# EAGLE design radio_hub_module (EAGLE 6.6.0)

## Sheet 1 of 3
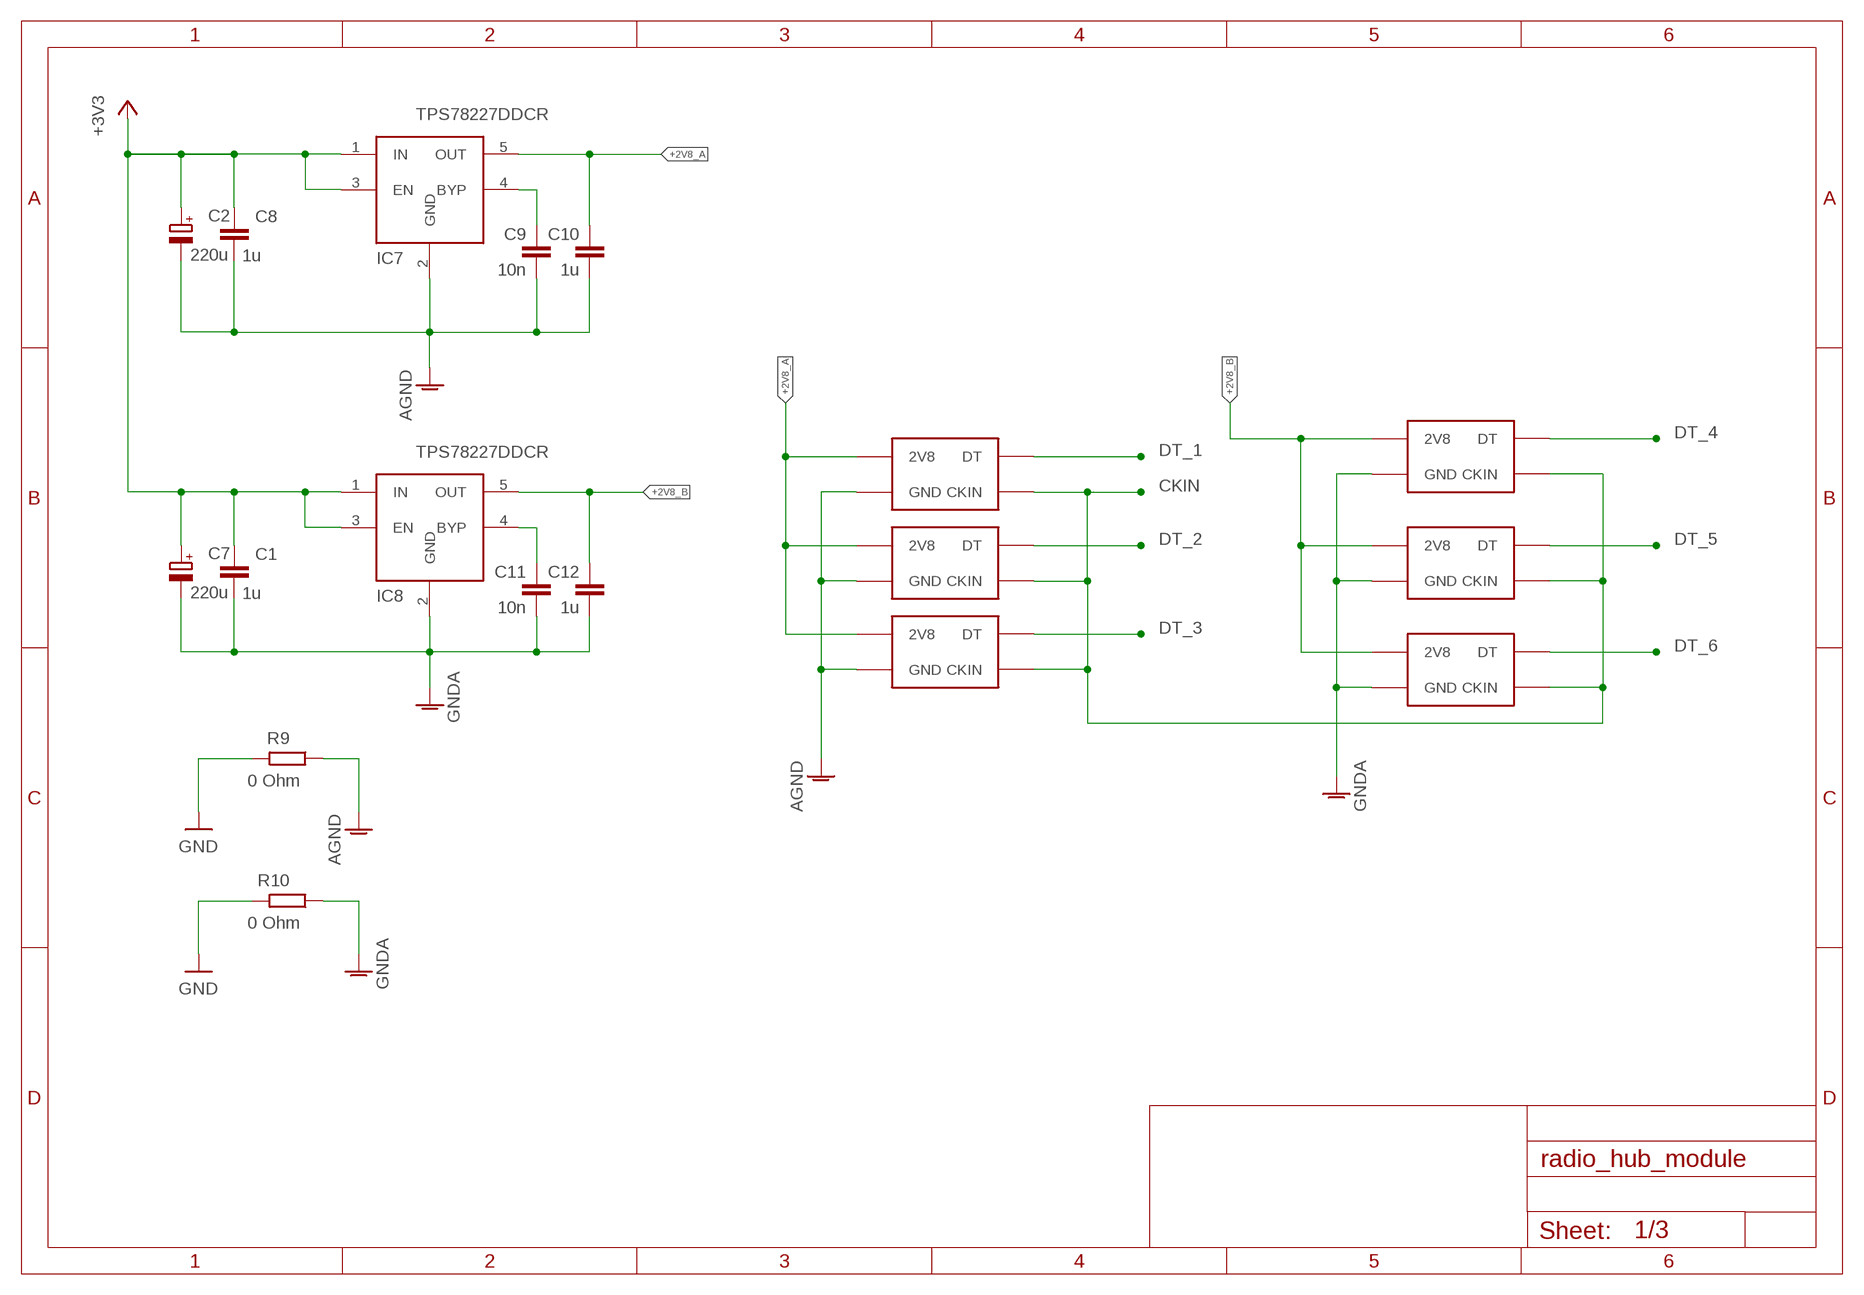
[diagram p0: schematic, sheet 1]

### Parts
C1  1u  C-EUC0603  [C0603]
C2  220u  CPOL-EU1210  [C1210]
C7  220u  CPOL-EU1210  [C1210]
C8  1u  C-EUC0603  [C0603]
C9  10n  C-EUC0603  [C0603]
C10  1u  C-EUC0603  [C0603]
C11  10n  C-EUC0603  [C0603]
C12  1u  C-EUC0603  [C0603]
IC7  TPS78227DDCR  NCP700BSN  [SOT23-5]
IC8  TPS78227DDCR  NCP700BSN  [SOT23-5]
MOD_1  GPS_RADIO_MODULE  [GPS_RADIO_MODULE]
MOD_2  GPS_RADIO_MODULE  [GPS_RADIO_MODULE]
MOD_3  GPS_RADIO_MODULE  [GPS_RADIO_MODULE]
MOD_4  GPS_RADIO_MODULE  [GPS_RADIO_MODULE]
MOD_5  GPS_RADIO_MODULE  [GPS_RADIO_MODULE]
MOD_6  GPS_RADIO_MODULE  [GPS_RADIO_MODULE]
R9  0 Ohm  R-EU_R0805  [R0805]
R10  0 Ohm  R-EU_R0805  [R0805]

### Nets
+2V8_A: C10.1 IC7.5(OUT) MOD_1.2V8@11(2V8) MOD_1.2V8@15(2V8) MOD_1.2V8@16(2V8) MOD_2.2V8@11(2V8) MOD_2.2V8@15(2V8) MOD_2.2V8@16(2V8) MOD_3.2V8@11(2V8) MOD_3.2V8@15(2V8) MOD_3.2V8@16(2V8)
+2V8_B: C12.1 IC8.5(OUT) MOD_4.2V8@11(2V8) MOD_4.2V8@15(2V8) MOD_4.2V8@16(2V8) MOD_5.2V8@11(2V8) MOD_5.2V8@15(2V8) MOD_5.2V8@16(2V8) MOD_6.2V8@11(2V8) MOD_6.2V8@15(2V8) MOD_6.2V8@16(2V8)
+3V3: C1.1 C2.1(+) C7.1(+) C8.1 IC7.1(IN) IC7.3(EN) IC8.1(IN) IC8.3(EN) ; also sheet 2,3
AGND: C2.2(-) C8.2 C9.2 C10.2 IC7.2(GND) MOD_1.GND@1(GND) MOD_1.GND@2(GND) MOD_1.GND@3(GND) MOD_1.GND@4(GND) MOD_1.GND@5(GND) MOD_1.GND@6(GND) MOD_1.GND@7(GND) MOD_1.GND@8(GND) MOD_1.GND@9(GND) MOD_1.GND@10(GND) MOD_1.GND@14(GND) MOD_1.V1(GND) MOD_1.V2(GND) MOD_1.V3(GND) MOD_1.V4(GND) MOD_1.V5(GND) MOD_1.V6(GND) MOD_1.V7(GND) MOD_1.V8(GND) MOD_1.V9(GND) MOD_1.V10(GND) MOD_1.V11(GND) MOD_1.V12(GND) MOD_1.V13(GND) MOD_1.V14(GND) MOD_1.V15(GND) MOD_1.V16(GND) MOD_1.V17(GND) MOD_1.V18(GND) MOD_1.V19(GND) MOD_1.V20(GND) MOD_1.V21(GND) MOD_1.V22(GND) MOD_1.V23(GND) MOD_1.V24(GND) MOD_1.V25(GND) MOD_1.V26(GND) MOD_1.V27(GND) MOD_1.V28(GND) MOD_1.V29(GND) MOD_1.V30(GND) MOD_2.GND@1(GND) MOD_2.GND@2(GND) MOD_2.GND@3(GND) MOD_2.GND@4(GND) MOD_2.GND@5(GND) MOD_2.GND@6(GND) MOD_2.GND@7(GND) MOD_2.GND@8(GND) MOD_2.GND@9(GND) MOD_2.GND@10(GND) MOD_2.GND@14(GND) MOD_2.V1(GND) MOD_2.V2(GND) MOD_2.V3(GND) MOD_2.V4(GND) MOD_2.V5(GND) MOD_2.V6(GND) MOD_2.V7(GND) MOD_2.V8(GND) MOD_2.V9(GND) MOD_2.V10(GND) MOD_2.V11(GND) MOD_2.V12(GND) MOD_2.V13(GND) MOD_2.V14(GND) MOD_2.V15(GND) MOD_2.V16(GND) MOD_2.V17(GND) MOD_2.V18(GND) MOD_2.V19(GND) MOD_2.V20(GND) MOD_2.V21(GND) MOD_2.V22(GND) MOD_2.V23(GND) MOD_2.V24(GND) MOD_2.V25(GND) MOD_2.V26(GND) MOD_2.V27(GND) MOD_2.V28(GND) MOD_2.V29(GND) MOD_2.V30(GND) MOD_3.GND@1(GND) MOD_3.GND@2(GND) MOD_3.GND@3(GND) MOD_3.GND@4(GND) MOD_3.GND@5(GND) MOD_3.GND@6(GND) MOD_3.GND@7(GND) MOD_3.GND@8(GND) MOD_3.GND@9(GND) MOD_3.GND@10(GND) MOD_3.GND@14(GND) MOD_3.V1(GND) MOD_3.V2(GND) MOD_3.V3(GND) MOD_3.V4(GND) MOD_3.V5(GND) MOD_3.V6(GND) MOD_3.V7(GND) MOD_3.V8(GND) MOD_3.V9(GND) MOD_3.V10(GND) MOD_3.V11(GND) MOD_3.V12(GND) MOD_3.V13(GND) MOD_3.V14(GND) MOD_3.V15(GND) MOD_3.V16(GND) MOD_3.V17(GND) MOD_3.V18(GND) MOD_3.V19(GND) MOD_3.V20(GND) MOD_3.V21(GND) MOD_3.V22(GND) MOD_3.V23(GND) MOD_3.V24(GND) MOD_3.V25(GND) MOD_3.V26(GND) MOD_3.V27(GND) MOD_3.V28(GND) MOD_3.V29(GND) MOD_3.V30(GND) R9.1
BYP: C9.1 IC7.4(BYP)
BYP1: C11.1 IC8.4(BYP)
CKIN: MOD_1.CKIN@13(CKIN) MOD_2.CKIN@13(CKIN) MOD_3.CKIN@13(CKIN) MOD_4.CKIN@13(CKIN) MOD_5.CKIN@13(CKIN) MOD_6.CKIN@13(CKIN) ; also sheet 2
DT_1: MOD_1.DT@12(DT) ; also sheet 3
DT_2: MOD_2.DT@12(DT) ; also sheet 3
DT_3: MOD_3.DT@12(DT) ; also sheet 3
DT_4: MOD_4.DT@12(DT) ; also sheet 3
DT_5: MOD_5.DT@12(DT) ; also sheet 3
DT_6: MOD_6.DT@12(DT) ; also sheet 3
GND: R9.2 R10.2 ; also sheet 2,3
GNDA: C1.2 C7.2(-) C11.2 C12.2 IC8.2(GND) MOD_4.GND@1(GND) MOD_4.GND@2(GND) MOD_4.GND@3(GND) MOD_4.GND@4(GND) MOD_4.GND@5(GND) MOD_4.GND@6(GND) MOD_4.GND@7(GND) MOD_4.GND@8(GND) MOD_4.GND@9(GND) MOD_4.GND@10(GND) MOD_4.GND@14(GND) MOD_4.V1(GND) MOD_4.V2(GND) MOD_4.V3(GND) MOD_4.V4(GND) MOD_4.V5(GND) MOD_4.V6(GND) MOD_4.V7(GND) MOD_4.V8(GND) MOD_4.V9(GND) MOD_4.V10(GND) MOD_4.V11(GND) MOD_4.V12(GND) MOD_4.V13(GND) MOD_4.V14(GND) MOD_4.V15(GND) MOD_4.V16(GND) MOD_4.V17(GND) MOD_4.V18(GND) MOD_4.V19(GND) MOD_4.V20(GND) MOD_4.V21(GND) MOD_4.V22(GND) MOD_4.V23(GND) MOD_4.V24(GND) MOD_4.V25(GND) MOD_4.V26(GND) MOD_4.V27(GND) MOD_4.V28(GND) MOD_4.V29(GND) MOD_4.V30(GND) MOD_5.GND@1(GND) MOD_5.GND@2(GND) MOD_5.GND@3(GND) MOD_5.GND@4(GND) MOD_5.GND@5(GND) MOD_5.GND@6(GND) MOD_5.GND@7(GND) MOD_5.GND@8(GND) MOD_5.GND@9(GND) MOD_5.GND@10(GND) MOD_5.GND@14(GND) MOD_5.V1(GND) MOD_5.V2(GND) MOD_5.V3(GND) MOD_5.V4(GND) MOD_5.V5(GND) MOD_5.V6(GND) MOD_5.V7(GND) MOD_5.V8(GND) MOD_5.V9(GND) MOD_5.V10(GND) MOD_5.V11(GND) MOD_5.V12(GND) MOD_5.V13(GND) MOD_5.V14(GND) MOD_5.V15(GND) MOD_5.V16(GND) MOD_5.V17(GND) MOD_5.V18(GND) MOD_5.V19(GND) MOD_5.V20(GND) MOD_5.V21(GND) MOD_5.V22(GND) MOD_5.V23(GND) MOD_5.V24(GND) MOD_5.V25(GND) MOD_5.V26(GND) MOD_5.V27(GND) MOD_5.V28(GND) MOD_5.V29(GND) MOD_5.V30(GND) MOD_6.GND@1(GND) MOD_6.GND@2(GND) MOD_6.GND@3(GND) MOD_6.GND@4(GND) MOD_6.GND@5(GND) MOD_6.GND@6(GND) MOD_6.GND@7(GND) MOD_6.GND@8(GND) MOD_6.GND@9(GND) MOD_6.GND@10(GND) MOD_6.GND@14(GND) MOD_6.V1(GND) MOD_6.V2(GND) MOD_6.V3(GND) MOD_6.V4(GND) MOD_6.V5(GND) MOD_6.V6(GND) MOD_6.V7(GND) MOD_6.V8(GND) MOD_6.V9(GND) MOD_6.V10(GND) MOD_6.V11(GND) MOD_6.V12(GND) MOD_6.V13(GND) MOD_6.V14(GND) MOD_6.V15(GND) MOD_6.V16(GND) MOD_6.V17(GND) MOD_6.V18(GND) MOD_6.V19(GND) MOD_6.V20(GND) MOD_6.V21(GND) MOD_6.V22(GND) MOD_6.V23(GND) MOD_6.V24(GND) MOD_6.V25(GND) MOD_6.V26(GND) MOD_6.V27(GND) MOD_6.V28(GND) MOD_6.V29(GND) MOD_6.V30(GND) R10.1

## Sheet 2 of 3
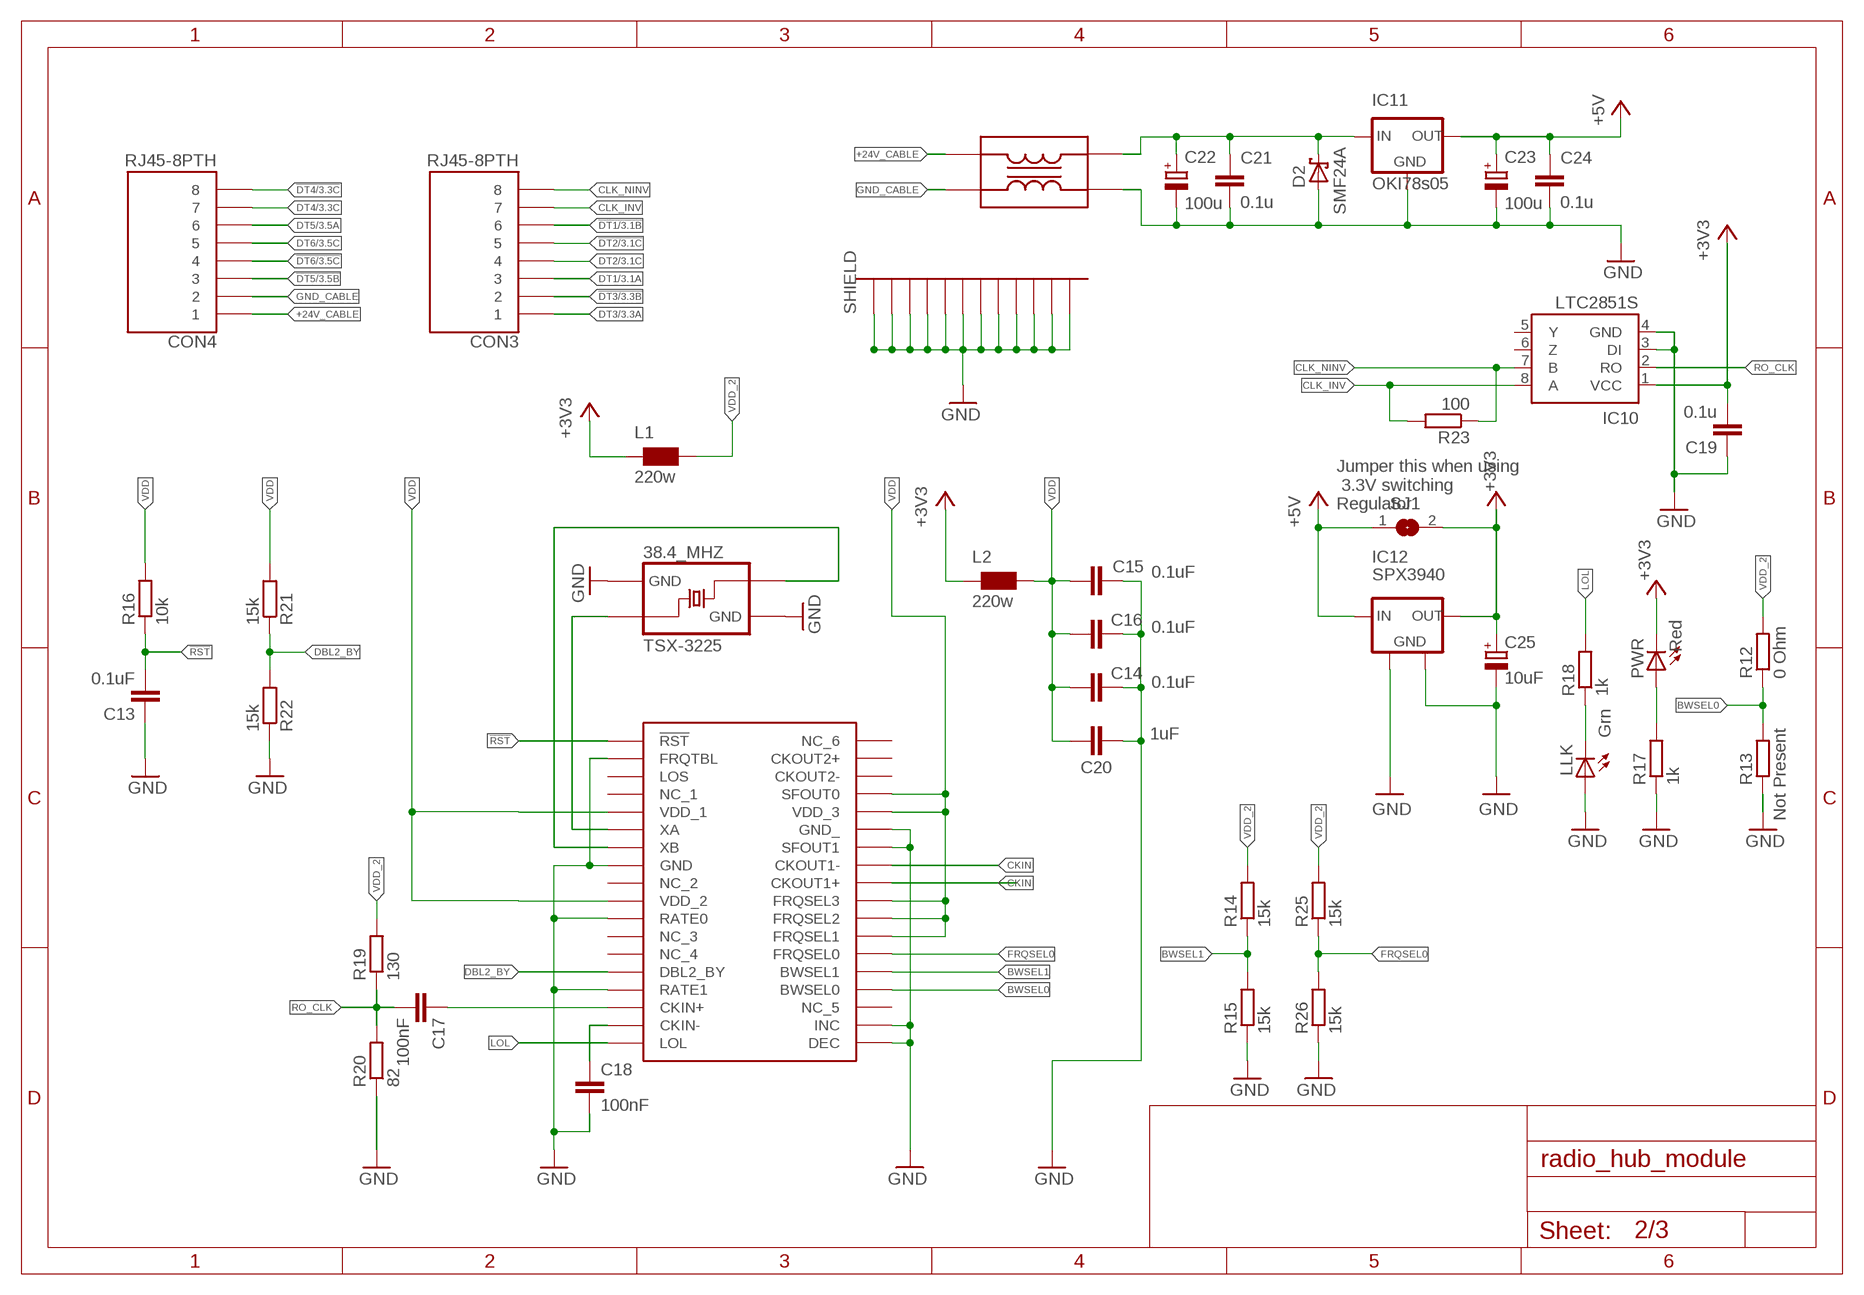
[diagram p1: schematic, sheet 2]

### Parts
38.4_MHZ  TSX-3225  [TSX-3225]
C13  0.1uF  C-EUC0402  [C0402]
C14  0.1uF  C-EUC0402  [C0402]
C15  0.1uF  C-EUC0402  [C0402]
C16  0.1uF  C-EUC0402  [C0402]
C17  100nF  C-EUC0402  [C0402]
C18  100nF  C-EUC0402  [C0402]
C19  0.1u  C-EUC0805  [C0805]
C20  1uF  C-EUC0402  [C0402]
C21  0.1u  C-EUC0805  [C0805]
C22  100u  CPOL-EUE5-10.5  [E5-10,5]
C23  100u  CPOL-EUE5-10.5  [E5-10,5]
C24  0.1u  C-EUC0805  [C0805]
C25  10uF  CPOL-EUE2-5  [E2-5]
CON3  RJ45-8PTH  [RJ45-8]
CON4  RJ45-8PTH  [RJ45-8]
D2  SMF24A  [SOD123]
IC9  SI5317  [QFN-36]
IC10  LTC2851S  [SOIC8]
IC11  OKI78s05  V_REG_OKI-78SRSINK  [TO220-IGO]
IC12  SPX3940  [SOT223]
L1  220w  WE-CBF_0805  [0805]
L2  220w  WE-CBF_0805  [0805]
L3  ACM3225-601-2P-T001  [ACM3225-601-2P-T001]
LLK  Grn  LEDCHIPLED_0805  [CHIPLED_0805]
PWR  Red  LEDCHIPLED_0805  [CHIPLED_0805]
R12  0 Ohm  R-EU_R0603  [R0603]
R13  Not Present  R-EU_R0603  [R0603]
R14  15k  R-EU_R0603  [R0603]
R15  15k  R-EU_R0603  [R0603]
R16  10k  R-EU_R0402  [R0402]
R17  1k  R-EU_R0603  [R0603]
R18  1k  R-EU_R0603  [R0603]
R19  130  R-EU_R0603  [R0603]
R20  82  R-EU_R0603  [R0603]
R21  15k  R-EU_R0603  [R0603]
R22  15k  R-EU_R0603  [R0603]
R23  100  R-EU_R0603  [R0603]
R25  15k  R-EU_R0603  [R0603]
R26  15k  R-EU_R0603  [R0603]
SH1  BMIS-202  [BMIS-202]
SJ1  SJ  [SJ]

### Nets
24V_IN: C21.1 C22.+ D2.C IC11.IN L3.4
!DT1: CON3.6 ; also sheet 3
!DT2: CON3.5 ; also sheet 3
!DT3: CON3.2 ; also sheet 3
!DT4: CON4.8 ; also sheet 3
!DT5: CON4.3 ; also sheet 3
!DT6: CON4.4 ; also sheet 3
!RST: C13.2 IC9.1(!RST) R16.1
+3V3: C19.2 C25.+ IC10.1(VCC) IC12.3(OUT) L1.1 L2.1 PWR.C SJ1.2 ; also sheet 1,3
+5V: C23.+ C24.1 IC11.OUT IC12.1(IN) SJ1.1
+24V_CABLE: CON4.1 L3.1
BWSEL0: IC9.22(BWSEL0) R12.1 R13.2
BWSEL1: IC9.23(BWSEL1) R14.1 R15.2
CKIN: IC9.28(CKOUT1+) IC9.29(CKOUT1-) ; also sheet 1
CKIN+: C17.1 IC9.16(CKIN+)
CKIN-: C18.1 IC9.17(CKIN-)
CLK_INV: CON3.7 IC10.8(A) R23.2
CLK_NINV: CON3.8 IC10.7(B) R23.1
DBL2_BY: IC9.14(DBL2_BY) R21.1 R22.2
DT1: CON3.3 ; also sheet 3
DT2: CON3.4 ; also sheet 3
DT3: CON3.1 ; also sheet 3
DT4: CON4.7 ; also sheet 3
DT5: CON4.6 ; also sheet 3
DT6: CON4.5 ; also sheet 3
FRQSEL0: IC9.24(FRQSEL0) R25.1 R26.2
GND: 38.4_MHZ.PIN_2(GND_2) 38.4_MHZ.PIN_4(GND_1) C13.1 C14.1 C15.1 C16.1 C18.2 C19.1 C20.1 C21.2 C22.- C23.- C24.2 C25.- D2.A IC9.2(FRQTBL) IC9.8(GND) IC9.11(RATE0) IC9.15(RATE1) IC9.19(DEC) IC9.20(INC) IC9.30(SFOUT1) IC9.31(GND_) IC10.3(DI) IC10.4(GND) IC11.GND IC12.2(GND) IC12.4(GND) L3.3 LLK.A R13.1 R15.1 R17.1 R20.1 R22.1 R26.1 SH1.P$1(GND) SH1.P$2(GND) SH1.P$3(GND) SH1.P$4(GND) SH1.P$5(GND) SH1.P$6(GND) SH1.P$7(GND) SH1.P$8(GND) SH1.P$9(GND) SH1.P$10(GND) SH1.P$11(GND) SH1.P$12(GND) ; also sheet 1,3
GND_CABLE: CON4.2 L3.2
LOL: IC9.18(LOL) R18.2
N$1: PWR.A R17.2
N$11: LLK.C R18.1
RO_CLK: C17.2 IC10.2(RO) R19.1 R20.2
VDD: C14.2 C15.2 C16.2 C20.2 IC9.5(VDD_1) IC9.10(VDD_2) IC9.25(FRQSEL1) IC9.26(FRQSEL2) IC9.27(FRQSEL3) IC9.32(VDD_3) IC9.33(SFOUT0) L2.2 R16.2 R21.2
VDD_2: L1.2 R12.2 R14.2 R19.2 R25.2
XA: 38.4_MHZ.PIN_1(CON_1) IC9.6(XA)
XB: 38.4_MHZ.PIN_3(CON_2) IC9.7(XB)
Unconnected: IC9.3(LOS) IC9.4(NC_1) IC9.9(NC_2) IC9.12(NC_3) IC9.13(NC_4) IC9.21(NC_5) IC9.34(CKOUT2-) IC9.35(CKOUT2+) IC9.36(NC_6) IC10.5(Y) IC10.6(Z)

### Notes on the sheet
- Jumper this when using
   3.3V switching
  Regulator

## Sheet 3 of 3
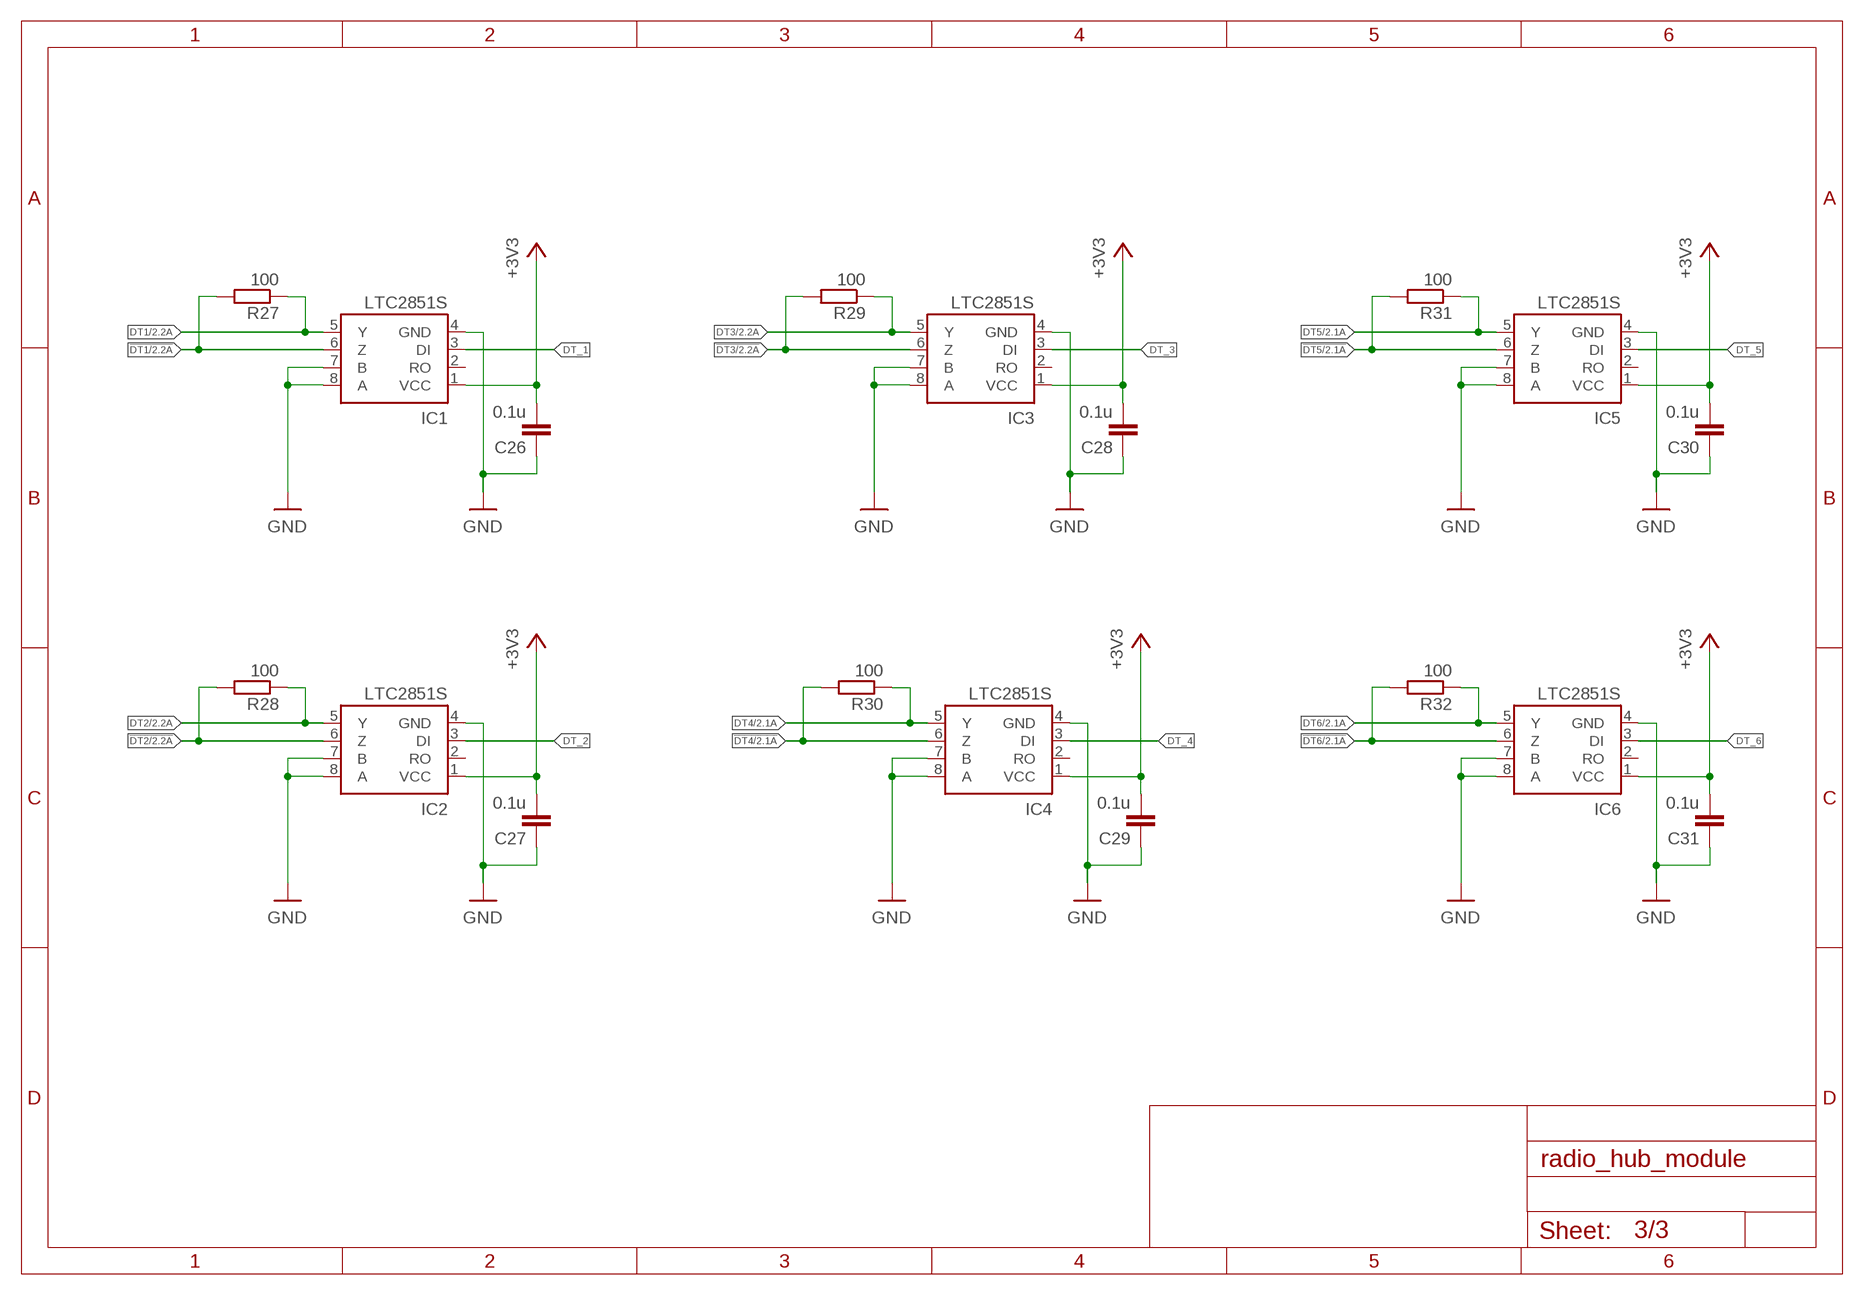
[diagram p2: schematic, sheet 3]

### Parts
C26  0.1u  C-EUC0805  [C0805]
C27  0.1u  C-EUC0805  [C0805]
C28  0.1u  C-EUC0805  [C0805]
C29  0.1u  C-EUC0805  [C0805]
C30  0.1u  C-EUC0805  [C0805]
C31  0.1u  C-EUC0805  [C0805]
IC1  LTC2851S  [SOIC8]
IC2  LTC2851S  [SOIC8]
IC3  LTC2851S  [SOIC8]
IC4  LTC2851S  [SOIC8]
IC5  LTC2851S  [SOIC8]
IC6  LTC2851S  [SOIC8]
R27  100  R-EU_R0603  [R0603]
R28  100  R-EU_R0603  [R0603]
R29  100  R-EU_R0603  [R0603]
R30  100  R-EU_R0603  [R0603]
R31  100  R-EU_R0603  [R0603]
R32  100  R-EU_R0603  [R0603]

### Nets
!DT1: IC1.6(Z) R27.2 ; also sheet 2
!DT2: IC2.6(Z) R28.2 ; also sheet 2
!DT3: IC3.6(Z) R29.2 ; also sheet 2
!DT4: IC4.6(Z) R30.2 ; also sheet 2
!DT5: IC5.6(Z) R31.2 ; also sheet 2
!DT6: IC6.6(Z) R32.2 ; also sheet 2
+3V3: C26.2 C27.2 C28.2 C29.2 C30.2 C31.2 IC1.1(VCC) IC2.1(VCC) IC3.1(VCC) IC4.1(VCC) IC5.1(VCC) IC6.1(VCC) ; also sheet 1,2
DT1: IC1.5(Y) R27.1 ; also sheet 2
DT2: IC2.5(Y) R28.1 ; also sheet 2
DT3: IC3.5(Y) R29.1 ; also sheet 2
DT4: IC4.5(Y) R30.1 ; also sheet 2
DT5: IC5.5(Y) R31.1 ; also sheet 2
DT6: IC6.5(Y) R32.1 ; also sheet 2
DT_1: IC1.3(DI) ; also sheet 1
DT_2: IC2.3(DI) ; also sheet 1
DT_3: IC3.3(DI) ; also sheet 1
DT_4: IC4.3(DI) ; also sheet 1
DT_5: IC5.3(DI) ; also sheet 1
DT_6: IC6.3(DI) ; also sheet 1
GND: C26.1 C27.1 C28.1 C29.1 C30.1 C31.1 IC1.4(GND) IC1.7(B) IC1.8(A) IC2.4(GND) IC2.7(B) IC2.8(A) IC3.4(GND) IC3.7(B) IC3.8(A) IC4.4(GND) IC4.7(B) IC4.8(A) IC5.4(GND) IC5.7(B) IC5.8(A) IC6.4(GND) IC6.7(B) IC6.8(A) ; also sheet 1,2
Unconnected: IC1.2(RO) IC2.2(RO) IC3.2(RO) IC4.2(RO) IC5.2(RO) IC6.2(RO)

## Power pins joined to a net without a drawn wire
GND: IC9.GND_PAD(GND) IC9.GND_VIA_1(GND) IC9.GND_VIA_2(GND) IC9.GND_VIA_3(GND) IC9.GND_VIA_4(GND) IC9.GND_VIA_5(GND)

## Library data of the parts
38.4_MHZ = texas_lvds:TSX-3225: MHz Range Crystal Unit Miniature Size Low Profile SMD
C1 C8-C21 C24 C26-C31 = rcl:C-EU: CAPACITOR, European symbol
C2 C7 = rcl_1:CPOL-EU: POLARIZED CAPACITOR, European symbol
C22 C23 C25 = rcl:CPOL-EU: POLARIZED CAPACITOR, European symbol
CON3 CON4 = SparkFun:RJ45-8: RJ45 Jack Simple RJ45, 8-pin connection - connector for common Cat5, Cat5e, and Cat6 Ethernet cables. Footprint not yet proven in production. Connector sku is PRT-00643; Breakout PCB sku is BOB-00716.
D2 = texas_lvds:SMF24A: TVS DIODE 200W SOD-123F 24V UNI by Littelfuse Inc
IC1-IC6 IC10 = texas_lvds:LTC2851: 3.3V 20Mbps RS485/RS422 Transceiver - Full Duplex no Enable Source: http://cds.linear.com/docs/Datasheet/285012fd.pdf
IC7 IC8 = on_ldo:NCP700B: NCP700B 200mA LDO Regulator
IC9 = texas_lvds:SI5317: Jitter attenuation without clock multiplication.
IC11 = texas_lvds:V_REG_OKI-78SR: Voltage Regulator Standard 7805 5V regulator. IGO (Input Ground Output). Spark Fun Electronics SKU : COM-00107
IC12 = texas_lvds:SPX3940: Voltage regulator with a low drop out voltage of 280mV (typical) at 1A
L1 L2 = wuerth-elektronik:WE-CBF: SMD EMI Suppression Ferrite Beads - excellent anti-EMI properties - low DCR - impedances till 3000 ohms - rated current up to 6 A
L3 = texas_lvds:ACM3225-601-2P-T001: TDK Common Mode Filter For High-speed Differential Signal Line / General Signal Line
LLK PWR = led:LED: LED OSRAM: - CHIPLED LG R971, LG N971, LY N971, LG Q971, LY Q971, LO R971, LY R971 LH N974, LH R974 LS Q976, LO Q976, LY Q976 LO Q996 - Hyper CHIPLED LW Q18S LB Q993, LB Q99A, LB R99A - SideLED LS A670, LO A670, LY A670, LG A670, LP A670 LB A673, LV A673, LT A673, LW A673 LH A674 LY A675 LS A676, LA A676, LO A676, LY A676, LW A676 LS A679, LY A679, LG A679 - Hyper Micro SIDELED® LS Y876, LA Y876, LO Y876, LY Y876 LT Y87S - SmartLED LW L88C, LW L88S LB L89C, LB L89S, LG L890 LS L89K, LO L89K, LY L89K LS L896, LA L896, LO L896, LY L896 - TOPLED LS T670, LO T670, LY T670, LG T670, LP T670 LSG T670, LSP T670, LSY T670, LOP T670, LYG T670 LG T671, LOG T671, LSG T671 LB T673, LV T673, LT T673, LW T673 LH T674 LS T676, LA T676, LO T676, LY T676, LB T676, LH T676, LSB T676, LW T676 LB T67C, LV T67C, LT T67C, LS T67K, LO T67K, LY T67K, LW E67C LS E67B, LA E67B, LO E67B, LY E67B, LB E67C, LV E67C, LT E67C LW T67C LS T679, LY T679, LG T679 LS T770, LO T770, LY T770, LG T770, LP T770 LB T773, LV T773, LT T773, LW T773 LH T774 LS E675, LA E675, LY E675, LS T675 LS T776, LA T776, LO T776, LY T776, LB T776 LHGB T686 LT T68C, LB T68C - Hyper Mini TOPLED® LB M676 - Mini TOPLED Santana® LG M470 LS M47K, LO M47K, LY M47K Source: http://www.osram.convergy.de LUXEON: - LUMILED® LXK2-PW12-R00, LXK2-PW12-S00, LXK2-PW14-U00, LXK2-PW14-V00 LXK2-PM12-R00, LXK2-PM12-S00, LXK2-PM14-U00 LXK2-PE12-Q00, LXK2-PE12-R00, LXK2-PE12-S00, LXK2-PE14-T00, LXK2-PE14-U00 LXK2-PB12-K00, LXK2-PB12-L00, LXK2-PB12-M00, LXK2-PB14-N00, LXK2-PB14-P00, LXK2-PB14-Q00 LXK2-PR12-L00, LXK2-PR12-M00, LXK2-PR14-Q00, LXK2-PR14-R00 LXK2-PD12-Q00, LXK2-PD12-R00, LXK2-PD12-S00 LXK2-PH12-R00, LXK2-PH12-S00 LXK2-PL12-P00, LXK2-PL12-Q00, LXK2-PL12-R00 Source: www.luxeon.com KINGBRIGHT: KA-3528ASYC Source: www.kingbright.com
MOD_1-MOD_6 = radio_module:GPS_RADIO_MODULE
R9 R10 R16-R18 R23 R27-R32 = rcl:R-EU_: RESISTOR, European symbol
R12-R15 R19-R22 R25 R26 = resistor:R-EU_: RESISTOR, European symbol
SH1 = laird:BMIS-202: Laird BMI-S-202 EMI Shield
SJ1 = jumper:SJ: SMD solder JUMPER

## Board
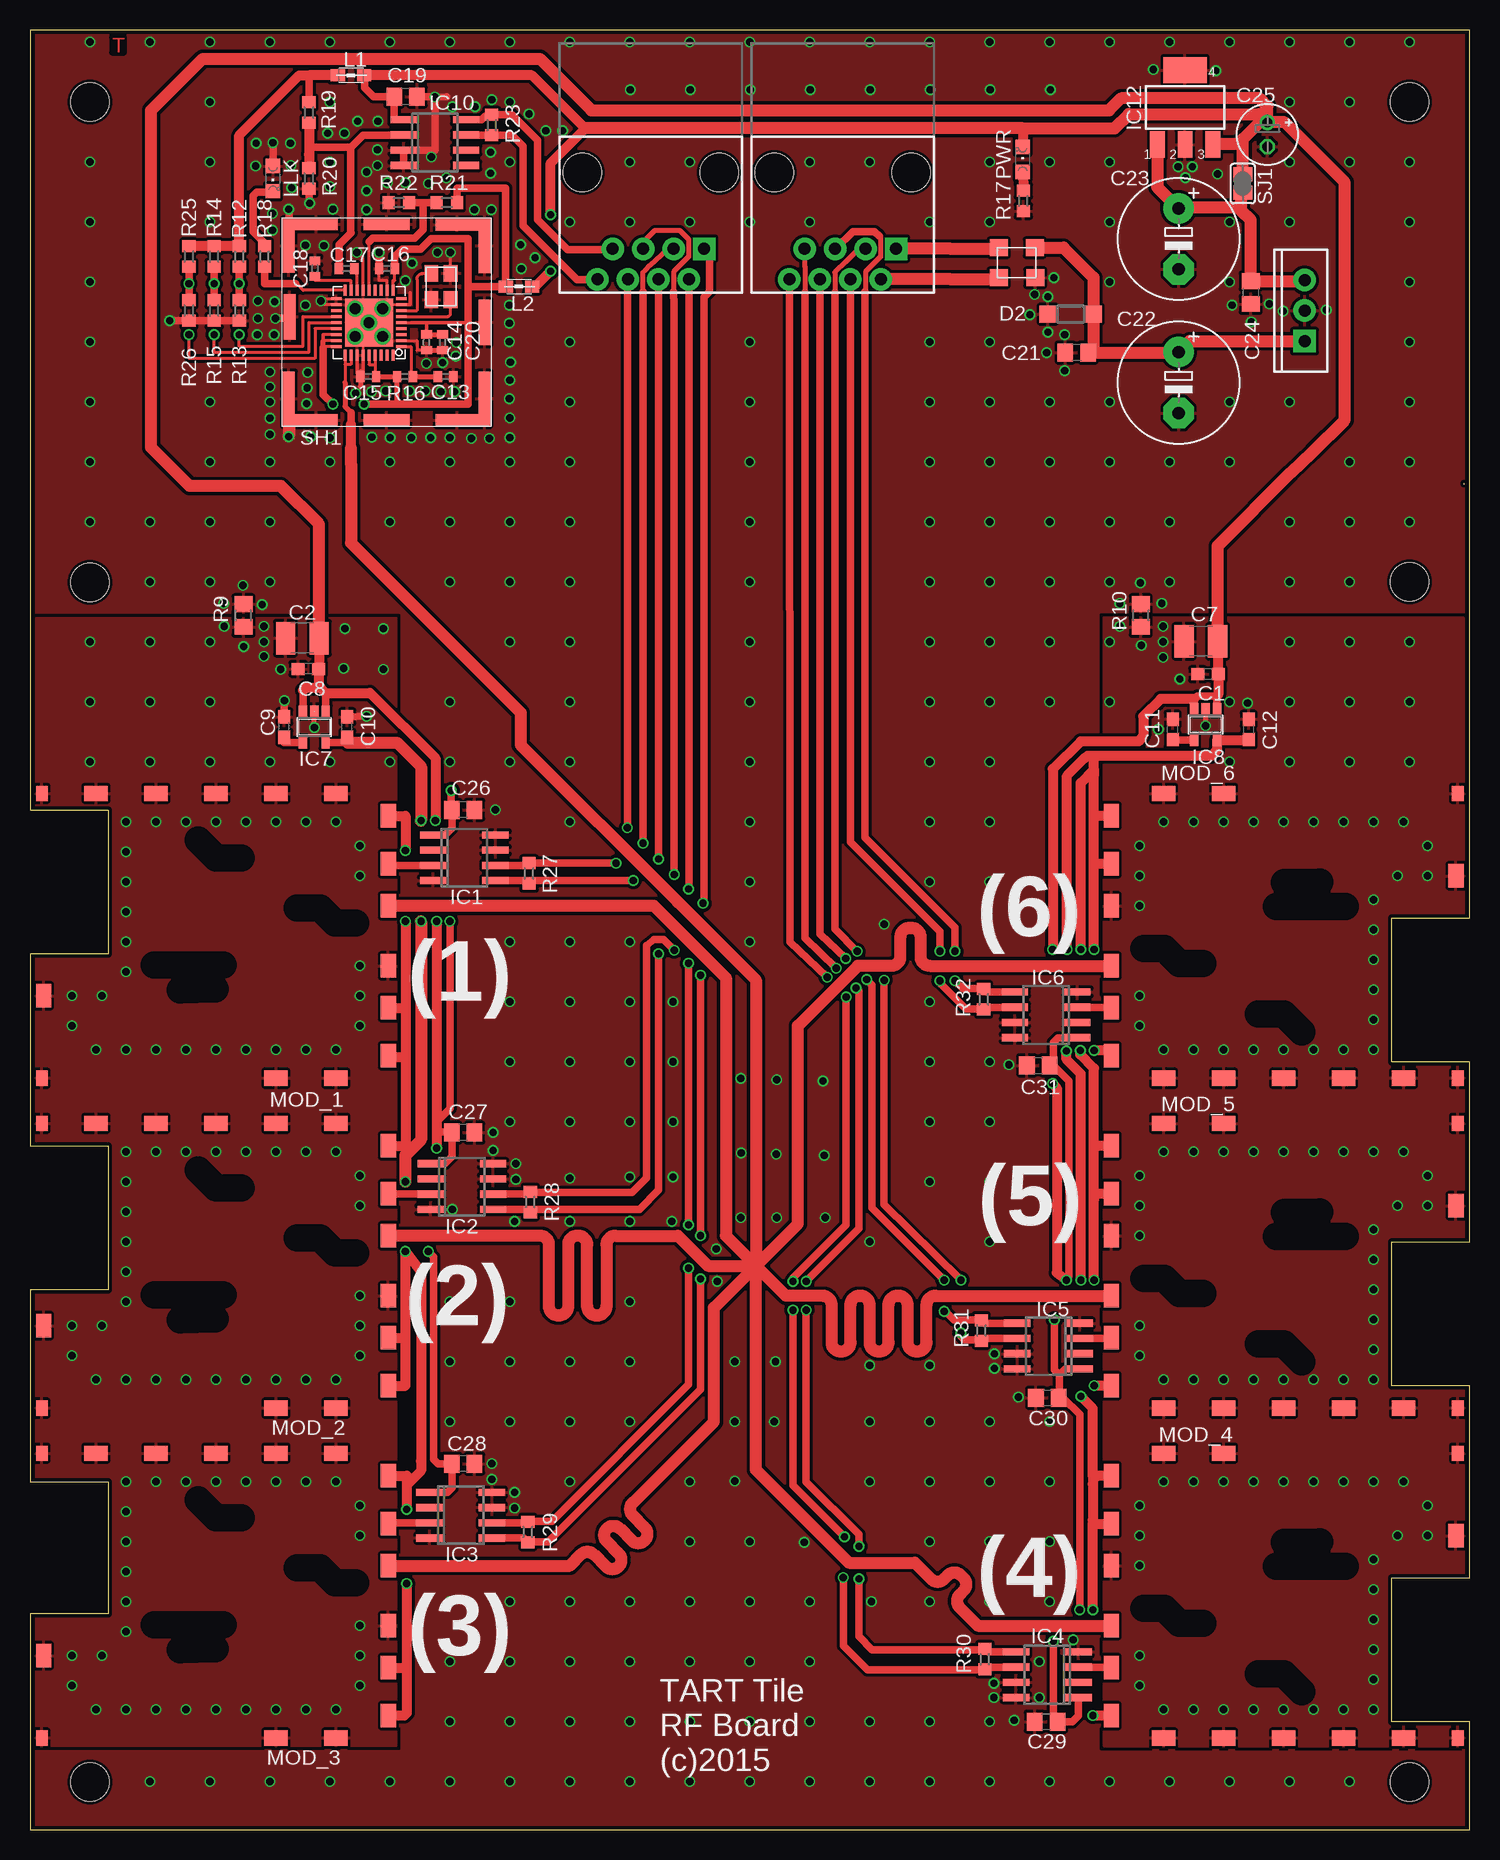
[diagram p3: board, top side]
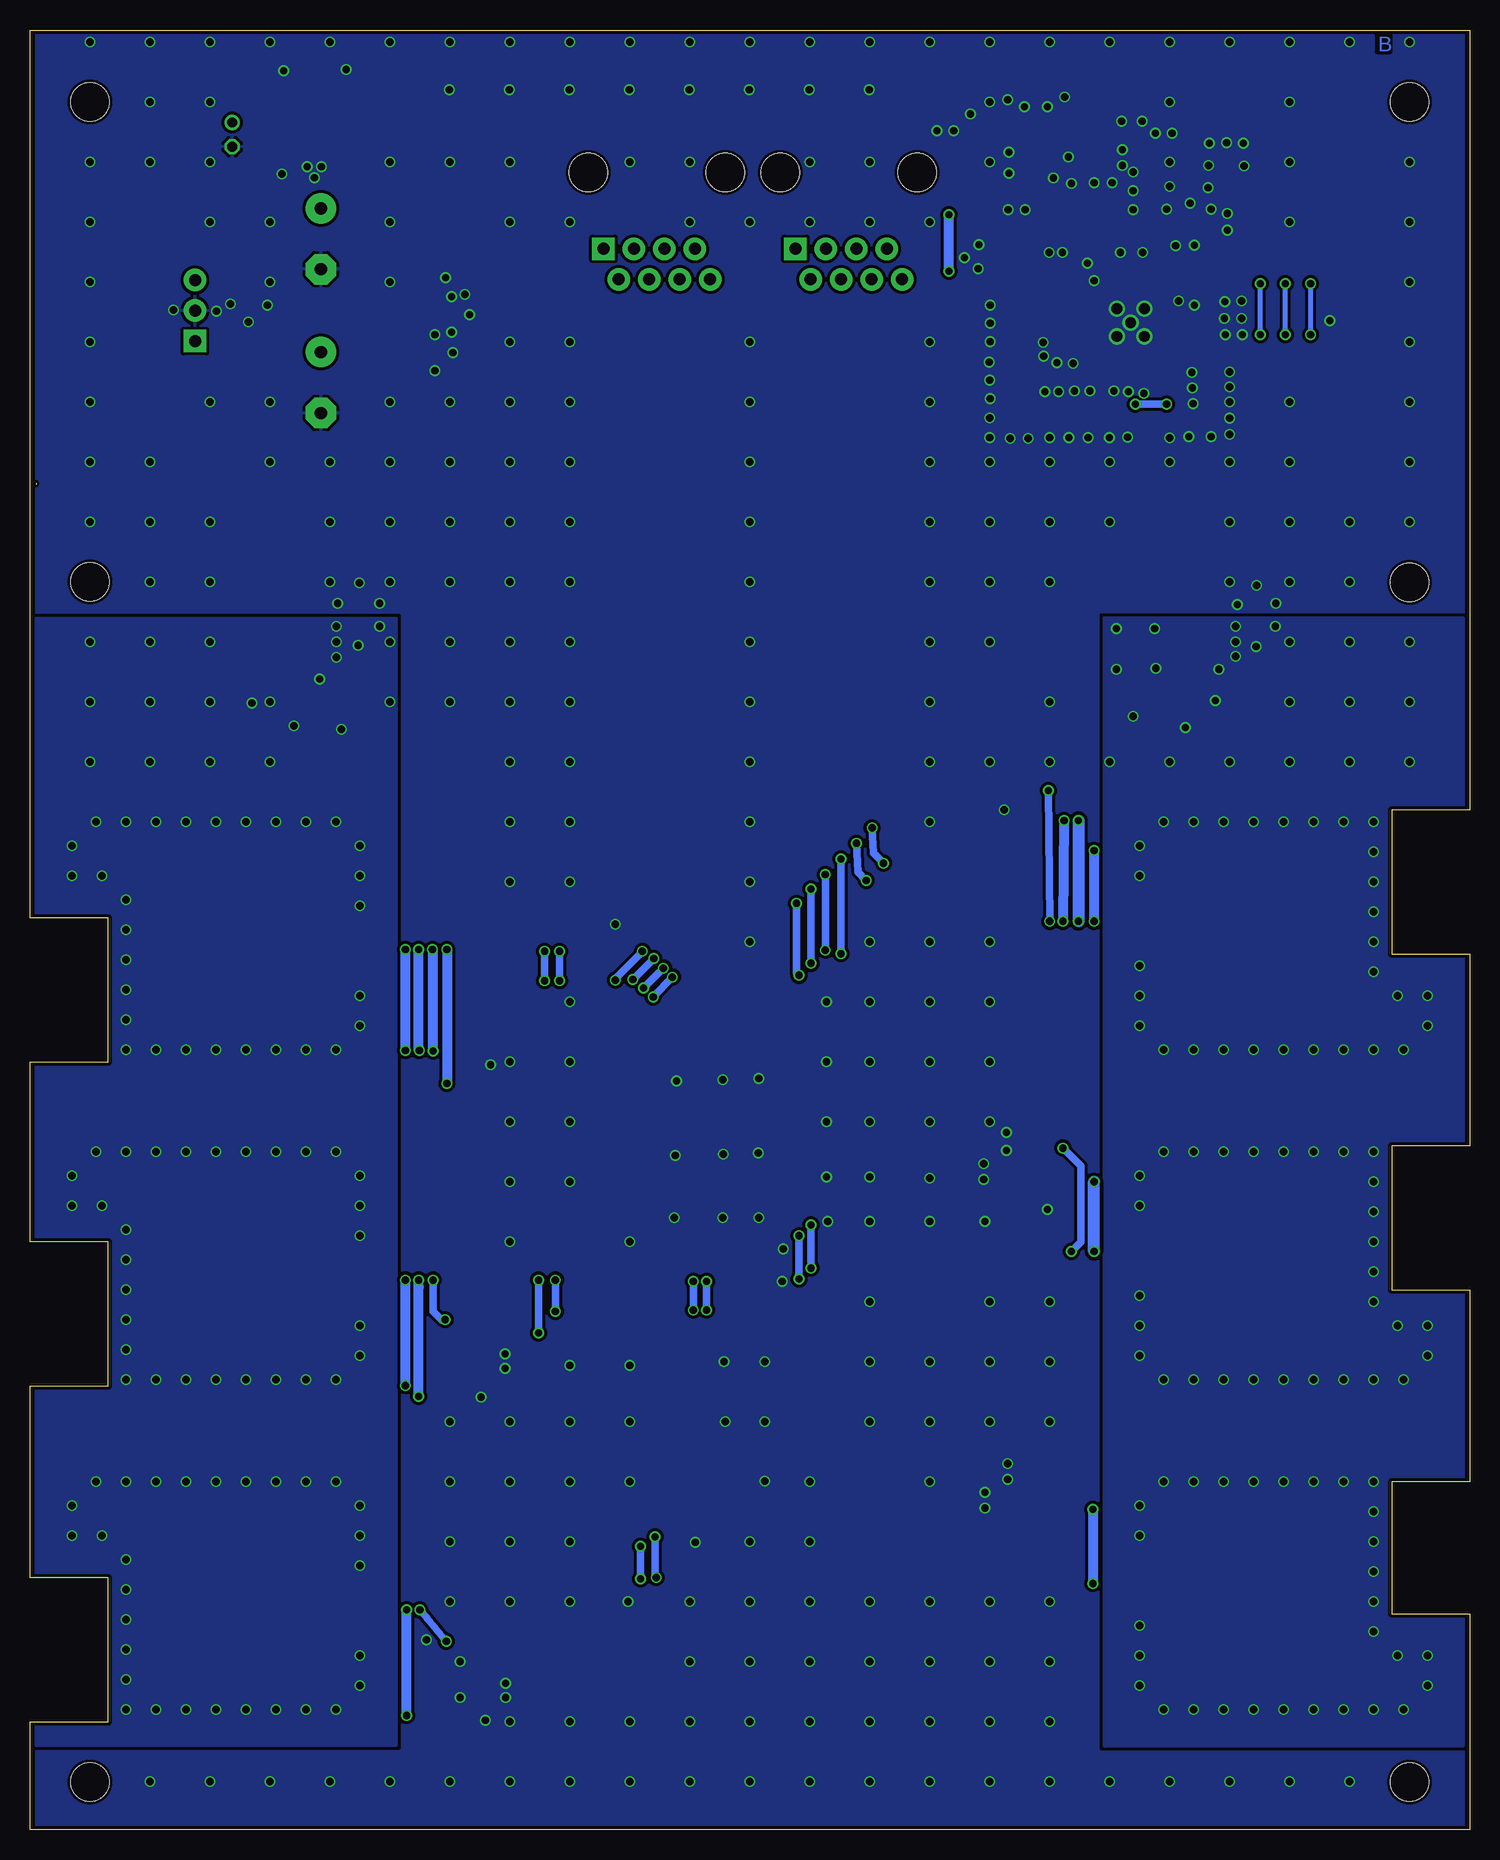
[diagram p4: board, bottom side, seen from below]

Size 120 x 150 mm. Coordinates in mm from the lower left corner, seen from the top.
Outline: 119.5,112.25 119.5,112.11
Outline: 0,150 0,85 6.5,85 6.5,73 0,73 0,57 6.5,57 6.5,46 6.5,45 0,45 0,29 6.5,29 6.5,18 0,18 0,0 120,0 120,9 113.5,9 113.5,21 120,21 120,37 113.5,37 113.5,49 120,49 120,64 113.5,64 113.5,76 120,76 120,150
Outline: 120,150 0,150
Outline: 120,150 0,150
Copper layers ((1+2)*(15+16)): Top 0.035mm / dielectric 0.2mm / Route2 0.035mm / dielectric 0.2mm / Route15 0.035mm / dielectric 0.2mm / Bottom 0.035mm
Design rules "4mil-4lyr": minimum track width 4mil, minimum drill 0.2mm, track to track 4mil, track to pad 4mil, pad to pad 4mil, via to via 4mil, smd to smd 0mil, copper to edge 8mil, drill to drill 8mil, minimum pad ring 4mil, minimum via ring 0.0953mm, stop-mask expansion 1mil, vias tented up to drill 1mm, thermal gap 10mil
Holes 3.2 mm at 5,103.96 5,144.01 115,104.01 115,144.01 5,3.96 115,3.96

### Footprints (pad centres in the part's own frame; a part is rotated, then mirrored left to right if it is on the bottom)
TSX-3225 = smd 1.4 x 1.15: PIN_1 -1.1,-0.8; PIN_2 1.1,-0.8; PIN_3 1.1,0.8; PIN_4 -1.1,0.8
C0603 = smd 1.1 x 1: 1 -0.85,0; 2 0.85,0
C1210 = smd 1.6 x 2.7: 1 -1.4,0; 2 1.4,0
C0402 = smd 0.7 x 0.9: 1 -0.65,0; 2 0.65,0
C0805 = smd 1.3 x 1.5: 1 -0.95,0; 2 0.95,0
E5-10,5 = drill 1.016 pad 2.54: + -2.54,0 | drill 1.016 pad 2.54 octagon: - 2.54,0
E2-5 = drill 0.813 pad 1.27: + -1.016,0 | drill 0.813 pad 1.27 octagon: - 1.016,0
RJ45-8 = drill 1 pad 1.88 square: 1 -4.445,6.35 | drill 1 pad 1.88: 2 -3.175,8.89; 3 -1.905,6.35; 4 -0.635,8.89; 5 0.635,6.35; 6 1.905,8.89; 7 3.175,6.35; 8 4.445,8.89 | hole 3.2: -5.715,0; 5.715,0
SOD123 = smd 1.4 x 1.4: A 1.9,0; C -1.9,0
SOIC8 = smd 0.6 x 2.2: 1 -1.905,-2.6; 2 -0.635,-2.6; 3 0.635,-2.6; 4 1.905,-2.6; 5 1.905,2.6; 6 0.635,2.6; 7 -0.635,2.6; 8 -1.905,2.6
SOT23-5 = smd 0.69 x 0.99: 1 -0.95,-1.29; 2 0,-1.29; 3 0.95,-1.29; 4 0.95,1.3; 5 -0.95,1.3
QFN-36 = smd 0.89 x 0.25: 1 -2.71,2; 2 -2.71,1.5; 3 -2.71,1; 4 -2.71,0.5; 5 -2.71,0; 6 -2.71,-0.5; 7 -2.71,-1; 8 -2.71,-1.5; 9 -2.71,-2; 19 2.71,-2; 20 2.71,-1.5; 21 2.71,-1; 22 2.71,-0.5; 23 2.71,0; 24 2.71,0.5; 25 2.71,1; 26 2.71,1.5; 27 2.71,2 | smd 0.25 x 0.89: 10 -2,-2.71; 11 -1.5,-2.71; 12 -1,-2.71; 13 -0.5,-2.71; 14 0,-2.71; 15 0.5,-2.71; 16 1,-2.71; 17 1.5,-2.71; 18 2,-2.71; 28 2,2.71; 29 1.5,2.71; 30 1,2.71; 31 0.5,2.71; 32 0,2.71; 33 -0.5,2.71; 34 -1,2.71; 35 -1.5,2.71; 36 -2,2.71 | smd 4 x 4: GND_PAD 0,0 | drill 0.9: GND_VIA_1 -1.15,1.15; GND_VIA_2 1.15,1.15; GND_VIA_3 0,0; GND_VIA_4 -1.15,-1.15; GND_VIA_5 1.15,-1.15
TO220-IGO = drill 1 pad 1.88: GND 0,0; OUT 2.54,0 | drill 1 pad 1.88 square: IN -2.54,0
SOT223 = smd 1.219 x 2.235: 1 -2.311,-3.099; 2 0,-3.099; 3 2.311,-3.099 | smd 3.6 x 2.2: 4 0,3.099
0805 = smd 1.2 x 1: 1 -1.1,0; 2 1.1,0
ACM3225-601-2P-T001 = smd 1.5 x 1.4: 1 -1.5,1.25; 2 -1.5,-1.25; 3 1.55,-1.25; 4 1.5,1.25
CHIPLED_0805 = smd 1.2 x 1.2: A 0,-1.05; C 0,1.05
GPS_RADIO_MODULE = smd 1.27 x 1.93: 2V8@11 0.635,2.5; 2V8@15 0.635,18.5; 2V8@16 0.635,22.5; CKIN@13 0.635,10; DT@12 0.635,6.5; GND@4 29.365,17.5; GND@14 0.635,15 | smd 1.93 x 1.27: GND@1 5,24.365; GND@2 10,24.365; GND@6 25,0.635; GND@7 20,0.635; GND@8 15,0.635; GND@9 10,0.635; GND@10 5,0.635 | smd 0.965 x 1.27: GND@3 29.517,24.365; GND@5 29.517,0.635 | drill 0.6: V1 5,22; V2 7.5,22; V3 10,22; V4 12.5,22; V5 15,22; V6 17.5,22; V7 20,22; V8 22.5,22; V9 25,22; V10 27,20; V11 27,17.5; V12 24.5,17.5; V13 22.5,15.5; V14 22.5,13; V15 22.5,10.5; V16 22.5,8; V17 22.5,5.5; V18 22.5,3; V19 20,3; V20 17.5,3; V21 15,3; V22 12.5,3; V23 10,3; V24 7.5,3; V25 5,3; V26 3,5; V27 3,7.5; V28 3,15; V29 3,17.5; V30 3,20
R0805 = smd 1.3 x 1.5: 1 -0.95,0; 2 0.95,0
R0603 = smd 1 x 1.1: 1 -0.85,0; 2 0.85,0
R0402 = smd 0.7 x 0.9: 1 -0.65,0; 2 0.65,0
BMIS-202 = smd 1 x 4.55: P$1 -7.675,-6.35; P$2 -7.675,6.425; P$3 8.625,6.4; P$4 8.625,-6.35 | smd 1 x 3.8: P$5 -7.6,0.475; P$7 8.625,0.025 | smd 3.8 x 1: P$6 0.475,8.2; P$8 0.475,-8.125 | smd 3.55 x 1: P$9 -5.4,-8.125; P$10 -5.4,8.2; P$11 6.35,8.175; P$12 6.35,-8.125
SJ = smd 1.168 x 1.6: 1 -0.762,0; 2 0.762,0

### Placement (x,y rotation side)
38.4_MHZ  34.25,128.61 90 top
C1  98.2,96.3 180 top
C2  22.7,99.3 180 top
C7  97.6,99.04 180 top
C8  23.2,96.75 180 top
C9  21.2,91.9 90 top
C10  26.45,91.9 90 top
C11  95.25,91.7 90 top
C12  101.6,91.7 90 top
C13  34.65,121.11 180 top
C14  33.05,123.96 90 top
C15  28.2,121.11 0 top
C16  29.75,130.11 0 top
C17  26.39,130.11 180 top
C18  23.75,130.11 90 top
C19  31.31,144.45 180 top
C20  34.4,123.96 90 top
C21  87.25,123.11 180 top
C22  95.75,120.61 270 top
C23  95.75,132.59 270 top
C24  101.75,128.11 270 top
C25  103.15,141.29 270 top
C26  36.1,85 180 top
C27  36.1,58.1 180 top
C28  36.1,30.5 180 top
C29  84.7,9 0 top
C30  84.8,36 0 top
C31  84.05,63.7 0 top
CON3  51.75,138.11 180 top
CON4  67.75,138.11 180 top
D2  86.75,126.31 180 top
IC1  36.2,81 270 top
IC2  36,53.6 270 top
IC3  35.9,26.2 270 top
IC4  84.8,12.9 90 top
IC5  84.9,40.3 90 top
IC6  84.7,67.9 90 top
IC7  23.7,91.9 180 top
IC8  98,92.1 180 top
IC9  28.25,125.61 180 top
IC10  33.75,140.61 270 top
IC11  106.25,126.61 90 top
IC12  96.29,143.55 0 top
L1  26.75,146.21 180 top
L2  40.75,128.61 180 top
L3  82.25,130.61 0 top
LLK  20.25,137.61 180 top
MOD_1  30.5,87 180 top
MOD_2  30.5,59.5 180 top
MOD_3  30.5,32 180 top
MOD_4  89.5,7 0 top
MOD_5  89.5,34.5 0 top
MOD_6  89.5,62 0 top
PWR  82.75,139.21 0 top
R9  17.8,101.2 90 top
R10  92.6,101.2 90 top
R12  17.45,131.11 90 top
R13  17.45,126.61 90 top
R14  15.35,131.11 90 top
R15  15.35,126.61 90 top
R16  31.25,121.11 180 top
R17  82.81,135.75 90 top
R18  19.55,131.11 270 top
R19  23.25,143.11 90 top
R20  23.25,137.61 90 top
R21  34.75,135.61 0 top
R22  30.75,135.61 0 top
R23  38.49,142.07 90 top
R25  13.25,131.11 90 top
R26  13.25,126.61 90 top
R27  41.6,79.7 90 top
R28  41.7,52.3 90 top
R29  41.5,24.8 90 top
R30  79.6,14.2 270 top
R31  79.3,41.6 270 top
R32  79.5,69.2 270 top
SH1  29.25,125.61 0 top
SJ1  101.1,137.2 90 top

### Tracks (layer width: path | path; a pad name or v marks a point on that pad's centre or on a via)
24V_IN
  Top 0.406: C21.1 88.65,123.11
  Top 1.016: L3.4 86.15,131.86 88.65,129.36 D2.C 88.65,123.11 | C21.1 88.65,123.11 | 88.65,123.11 95.71,123.11 C22.+ 96.67,124.07 IC11.IN
!DT1  (via drill 0.6)
  Top 0.61: IC1.6 41.41,80.36 R27.2 v48.85,80.55 | v49.8,83.5 49.8,129.07 CON3.6
  Bottom 0.61: v48.85,80.55 48.9,80.6 49.7,81.4 v49.8,83.5
!DT2  (via drill 0.6)
  Top 0.406: CON3.5 51.12,131.59 51.2,131.5 51.2,132.4 52.1,133.3 54.15,133.3 54.9,132.55 54.9,131.1 53.65,129.85 53.65,128.2
  Top 0.61: IC2.6 41.52,52.97 R28.2 41.75,53.1 50.2,53.1 51.4,54.3 51.4,73.7 52,74.2 52.8,74.2 v53.7,73.3 | 53.65,128.2 53.65,127.75 53.7,127.5 53.7,82.2 v53.7,79.6
  Bottom 0.61: v53.7,79.6 v53.7,73.3
!DT3  (via drill 0.6)
  Top 0.61: IC3.6 41.41,25.57 R29.2 41.55,25.7 43.5,25.7 54.9,37.1 v54.9,46.8 | CON3.2 54.92,78.33 v54.9,78.4 | v54.9,72.2 54.9,51.5 v54.9,50.4
  Bottom 0.61: v54.9,78.4 54.9,72.3 v54.9,72.2 | v54.9,50.4 v54.9,46.8
!DT4  (via drill 0.6)
  Top 0.61: IC4.6 79.78,13.54 R30.2 79.55,13.3 69.8,13.3 67.8,15.3 v67.8,21 | CON4.8 63.35,74 v66.45,71.05 | v68.05,69.4 68,69.25 68,50.4 63.6,46 v63.6,45.7 | v63.6,43.3 63.6,28.7 v67.9,24.4
  Bottom 0.61: v66.45,71.05 v68.05,69.4 | v63.6,45.7 v63.6,43.3 | v67.9,24.4 67.9,21.1 v67.8,21
!DT5  (via drill 0.6)
  Top 0.406: 67.1,128.1 67.1,129.8 68,130.7 69.05,131.75 69.64,131.75 CON4.3
  Top 0.61: IC5.6 79.48,40.94 R31.2 79.25,40.8 77.9,40.8 77.6,41.1 v77.6,41.4 | 67.1,128.1 67.1,75.05 v68.95,73.2 | v71.2,70.8 71.2,52.1 v77.6,45.8
  Bottom 0.61: v68.95,73.2 71.2,70.95 v71.2,70.8 | v77.6,45.8 v77.6,41.4
!DT6  (via drill 0.6)
  Top 0.61: IC6.6 79.69,68.53 R32.2 79.45,68.4 78,68.4 75.85,70.55 v75.85,70.75 | CON4.4 68.39,82.31 75.85,74.85 v75.85,73.2
  Bottom 0.61: v75.85,73.2 v75.85,70.75
!RST
  Top 0.254: IC9.1 31.75,123.61 31.75,121.11
  Top 0.305: 31.75,121.11 R16.1
  Top 0.4: 32.25,121.11 R16.1
  Top 0.406: 32.25,121.11 C13.2
+2V8_A  (via drill 0.6)
  Top 0.61: C10.1 26.45,90.6 IC7.5
  Top 0.813: 26.45,90.6 26.5,90.6 | v31.4,20.5 31.4,13.6 | 31.4,13.6 31.4,9.7 31.2,9.5 MOD_3.2V8@16 | MOD_3.2V8@15 31.3,13.5 31.4,13.6 | MOD_3.2V8@11 31.4,29.5 31.4,29 v31.4,26.7 31.4,28.7 32.6,29.9 32.6,30.7 32.6,46.5 v31.3,48.2 31.3,40.9 | MOD_2.2V8@16 31.3,37 31.3,40.9 | MOD_2.2V8@15 31.2,41 31.3,40.9 | MOD_2.2V8@11 31.3,57 31.3,56.9 31.3,56.2 31.3,64.4 | MOD_1.2V8@15 31.3,68.5 | 31.3,68.5 31.3,64.4 | MOD_1.2V8@16 29.96,64.4 31.3,64.4 | MOD_1.2V8@11 31.3,84.5 v31.3,81.6 | v31.3,75.7 31.3,68.5
  Top 1.016: 26.5,90.6 30.6,90.6 32.6,88.6 v32.6,84.1 | v32.6,75.7 32.6,57.5 31.3,56.2 v31.3,54
  Bottom 0.813: v31.4,26.7 v31.4,20.5 | v31.3,81.6 v31.3,75.7
  Bottom 1.016: v32.6,84.1 v32.6,75.7 | v31.3,48.2 v31.3,54
+2V8_B  (via drill 0.6)
  Top 0.61: 88.6,25.5 88.6,25.8
  Top 0.813: MOD_4.2V8@15 88.6,25.5 v88.6,18.3 | 88.6,29.5 MOD_4.2V8@16 88.6,29.5 | 88.6,29.5 88.6,28.8 88.6,25.8 | MOD_4.2V8@11 89.3,9.5 v88.6,9.5 | 88.7,89.5 98.5,89.5 98.95,89.95 IC8.5 101.55,90.8 C12.1 | 88.7,89.5 88.4,89.5 88.15,89.5 | MOD_6.2V8@11 90.15,64.55 89.75,64.95 v88.7,64.95 | v88.7,73.35 88.7,80.5 | 88.7,80.5 88.7,84.4 88.7,84.5 | MOD_6.2V8@15 88.7,80.5 | MOD_5.2V8@16 89.1,57 | 89.1,57 88.7,57 | 88.7,57 89.1,57 | 89.1,57 88.7,57 | 88.7,57 88.7,63.45 87.55,64.6 v87.55,64.95 | MOD_5.2V8@15 89.6,53 88.7,53 | 88.7,53 88.7,57 | 88.7,57 88.7,57.1 88.7,57 | MOD_5.2V8@11 v88.7,37 | v88.7,45.8 88.7,52.5 88.7,53 | 88.6,29.5 89.1,29.5 88.6,29.5 | 88.6,29.5 88.6,35.1 v87.6,36.1 | v87.6,45.8 87.6,63 86.4,64.2 v86.4,64.9 | v86.45,73.35 86.45,87.85 87.9,89.3 88.15,89.5 | v87.6,73.35 87.6,87.25 88.7,88.35 | 88.7,88.35 88.7,87.9 88.7,88.35 | 88.7,88.35 88.7,89.5 | 88.7,89.5 88.15,89.5 | 88.7,84.5 88.7,84.6 | 88.7,84.6 88.7,88.35 | MOD_6.2V8@16 88.7,84.5 | 88.7,84.5 88.7,84.6
  Bottom 0.813: v88.6,9.5 v88.6,18.3 | v88.7,64.95 v88.7,73.35 | v87.55,64.95 87.6,64.95 87.6,73.15 v87.6,73.35 | v88.7,37 v88.7,45.8 | v87.6,36.1 87.6,45.2 87.6,45.7 v87.6,45.8 | v86.4,64.9 86.4,64.95 86.4,73.2 v86.45,73.35
+3V3  (via drill 0.6)
  Top 0.406: 30.36,142.51 IC10.1 | IC2.1 34.6,55.51 | 35.2,85.05 C26.2
  Top 0.61: 87.3,10.99 IC4.1 87.4,9.5 86.9,9 C29.2 85.3,9.35 v85.3,15.7 | 30.36,142.51 C19.2 28.65,144.45 27.9,145.2 27.9,146.16 L1.1 | IC5.1 86.3,38.4 85.8,37.9 | IC6.1 85.69,66 85.3,65.6 85.3,63.7 C31.2 85.45,63.55 86.6,62.4 86.6,46.1 v86.4,45.8 | IC1.1 34.6,82.91 35.2,83.5 35.2,85.05 | 34.6,55.51 35.2,56.1 35.2,58.05 C27.2 35.1,58.15 33.8,58.15 v33.9,56.8 | IC3.1 34.8,28.11 35.2,28.5 35.2,30.45 C28.2 34,30.5 33.65,30.85 33.65,47.75 v33.2,48.2 | 85.8,37.9 85.8,36.05 C30.2 86.1,36 87.5,34.6 87.5,29.3 87.5,29.2 87.5,18.5 v87.5,18.3 | 33.9,59 35,60.1 v35,75.7 | v35.1,86.6 35.1,85.05 C26.2 | v85.4,42.5 85.4,38.3 85.8,37.9 | IC8.1 98.95,94.5 97.3,94.5 97.05,94.25 IC8.3 | IC7.1 24.65,94.75 | IC7.3 22.75,94.95
  Top 0.813: L1.1 30.36,146.21 41.85,146.21 46.26,141.8 46.3,141.8 43.4,138.9 v43.4,134.6 | 82.75,141.8 PWR.C | L2.1 42.11,128.61 v43.4,129.9 | 97.05,94.25 94.25,94.25 92.8,92.8 92.8,91.2 92.4,90.7 87.6,90.7 85.25,88.4 v85.25,73.35 | v85.25,62.2 85.6,61.8 85.6,46.4 v86.4,45.8 | 22.75,94.95 23,95.2 24.2,95.2 | v33.8,84.1 33.8,89.3 28.35,94.75 24.65,94.75 24.2,95.2 | v33.9,75.7 33.9,59 v33.9,56.8 | C2.1 24.1,96.8 C8.1 24.05,95.35 24.2,95.2 | C7.1 99,96.35 C1.1 99.05,94.6 98.95,94.5
  Top 1.016: 46.26,141.8 82.75,141.8 90.4,141.8 91.6,143 102.45,143 C25.+ | C7.1 99,107 105.1,113.1 106.9,114.8 109.6,117.5 109.6,135.9 109.6,137.3 104.6,142.3 C25.+ | C2.1 24.1,108.8 20.9,112 13.3,112 10.1,115.2 10.1,143.3 14.4,147.6 42.5,147.6 46.8,143.3 89.95,143.3 90.95,144.3 102.5,144.3 103.15,143.65 C25.+ | C25.+ 102.5,142.3 101.1,140.9 | 101.1,140.9 100.7,140.5 98.65,140.5 IC12.3 | SJ1.2 101.1,138.76 101.1,140.9
  Bottom 0.61: v33.2,48.2 32.4,49 32.4,55.3 v33.9,56.8 | v35,75.7 v35.1,86.6 | v87.5,18.3 86.9,17.6 v85.3,15.7 | v86.4,45.8 86.4,43.2 85.7,42.5 v85.4,42.5
  Bottom 0.813: v43.4,129.9 v43.4,134.6 | v85.25,73.35 v85.25,62.2 | v33.8,84.1 v33.9,75.7
+5V
  Top 1.016: IC11.OUT 106.16,129.06 C24.1 101.75,134.15 100.95,134.95 | 100.95,134.95 100.7,135.2 95.82,135.2 C23.+ 93.98,136.9 IC12.1 | SJ1.1 100.95,136.44 100.95,134.95
+24V_CABLE
  Top 0.406: 80.75,131.76 L3.1
  Top 1.016: 80.75,131.76 76.75,131.76 CON4.1
AGND  (via drill 0.6)
  Top 0.406: v23.7,91.85 IC7.2
  Top 0.61: v28.05,92.8 C10.2 | v21.2,94.1 C9.2
  other vias: 20.9,96.7 19.5,97.8 19.5,99 19.5,100.3 17.8,98.6 16.2,100.3 26.25,100.1 29.45,100.1 29.45,96.7 26.15,96.8 5,99 10,99 15,99 15,94 10,94 5,94 5,89 10,89 15,89 20,89 25,89 30,89
  pour Top (isolate 0.254): 0.5,101 30.5,101 30.5,7 0.5,7 0.5,18 6.5,18 6.5,29 0.5,29 0.5,45 6.5,45 6.5,57 0.5,57 0.5,73 6.5,73 6.5,85 0.5,85
  pour Bottom (isolate 0.254): 0.5,29 0.5,45 6.5,45 6.5,57 0.5,57 0.5,73 6.5,73 6.5,85 0.5,85 0.5,101 30.5,101 30.5,7 0.5,7 0.5,18 6.5,18 6.5,29
BWSEL0  (via drill 0.6)
  Top 0.254: IC9.22 22.75,126.11 22.75,123.61 17.45,123.61 v17.45,124.61
  Top 0.61: R12.1 v17.45,128.86 R13.2
  Bottom 0.406: v17.45,124.61 v17.45,128.86
BWSEL1  (via drill 0.6)
  Top 0.254: IC9.23 23.25,125.61 23.25,123.11 15.35,123.11 v15.35,124.61
  Top 0.61: R15.2 v15.35,128.86 R14.1
  Bottom 0.406: v15.35,124.61 v15.35,128.86
BYP
  Top 0.61: IC7.4 21.2,90.6 C9.1
BYP1
  Top 0.61: C11.1 95.25,90.8 IC8.4
CKIN
  Top 0.254: IC9.28 26.25,122.11 | 26.25,122.11 26.25,120.61 | IC9.29 26.75,122.11 26.25,122.11
  Top 0.406: 26.25,120.61 26.25,118.61 26.75,118.11
  Top 0.61: 26.75,117.11 26.75,118.11
  Top 0.813: 26.75,115.11 26.75,117.11
  Top 1.016: MOD_3.CKIN@13 45,22 45.92,22.93 arc-90 47,22.93 48,21.93 arc90 49.07,21.93 49.08,21.93 arc90 49.08,23.01 48.09,24.01 arc-90 48.09,25.09 48.09,25.09 arc-90 49.17,25.09 50.16,24.09 arc90 51.24,24.09 51.24,24.1 arc90 51.24,25.18 50.25,26.17 arc-90 50.25,27.25 57,34 57,43.5 60.5,47 | MOD_5.CKIN@13 75.5,44.5 arc90 74.74,43.74 74.74,40.61 arc-90 73.98,39.85 73.92,39.85 arc-90 73.15,40.61 73.15,43.74 arc90 72.39,44.5 72.33,44.5 arc90 71.57,43.74 71.57,40.61 arc-90 70.81,39.85 70.75,39.85 arc-90 69.98,40.61 69.98,43.74 arc90 69.22,44.5 69.16,44.5 arc90 68.4,43.74 68.4,40.61 arc-90 67.64,39.85 67.58,39.85 arc-90 66.82,40.61 66.82,43.74 arc90 66.05,44.5 63,44.5 60.5,47 | MOD_2.CKIN@13 42.5,49.5 arc-90 43.26,48.74 43.26,43.61 arc90 44.02,42.85 44.1,42.85 arc90 44.86,43.61 44.86,48.74 arc-90 45.62,49.5 45.69,49.5 arc-90 46.45,48.74 46.45,43.61 arc90 47.22,42.85 47.29,42.85 arc90 48.05,43.61 48.05,48.74 arc-90 48.81,49.5 54,49.5 56.5,47 60.5,47 | MOD_6.CKIN@13 75,72 arc-90 74.24,72.76 74.24,74.39 arc90 73.48,75.16 73.32,75.16 arc90 72.56,74.39 72.56,72.76 arc-90 71.8,72 69,72 64,67 64,50.5 60.5,47 | 60.5,47 60.5,30 64,26.5 68.25,22.25 73.75,22.25 75.12,20.88 arc90 76.2,20.88 76.52,21.2 arc-90 77.6,21.2 77.82,20.97 arc-90 77.82,19.9 77.5,19.58 arc90 77.5,18.5 79,17 MOD_4.CKIN@13 | 60.5,47 58,49.5 58,71 52,77 MOD_1.CKIN@13 | 60.5,47 60.5,70.8 54,77.3 40.9,90.4 40.9,93.1 26.75,107.25 26.75,113.84 26.75,115.11
CKIN+
  Top 0.254: IC9.16 27.25,130.11 C17.1
CKIN-
  Top 0.254: IC9.17 26.75,129.11 23.75,129.11 C18.1
CLK_INV
  Top 0.61: IC10.8 37.66,142.51 37.95,142.81 38.38,142.81 R23.2 40.18,142.92 42.3,140.8 42.3,134.2 44.8,131.7 48.52,131.7 CON3.7
CLK_NINV
  Top 0.61: IC10.7 38.47,141.25 R23.1 40.18,141.22 41.1,140.3 41.1,133.7 45.6,129.2 47.28,129.2 CON3.8
DBL2_BY
  Top 0.254: IC9.14 28.25,132.36
  Top 0.61: 28.25,132.36 28.55,132.66 32.05,132.66 32.75,133.36 32.75,134.11 32.75,135.61 | 32.75,135.61 R22.2 | 32.75,135.61 R21.1
DT1  (via drill 0.6)
  Top 0.406: 51.1,128.2 51.1,129.8 51.3,130 51.7,130.4 53.1,131.7 53.7,131.7 CON3.3
  Top 0.61: IC1.5 41.35,79.09 | 41.35,79.09 R27.1 | 41.35,79.09 v50.3,79.09 | v51.1,82.2 51.1,127.7 51.1,127.8 51.1,128.2
  Bottom 0.61: v50.3,79.09 v50.3,79.1 51,79.8 v51.1,82.2
DT2  (via drill 0.6)
  Top 0.61: IC2.5 41.45,51.7 | 41.45,51.7 R28.1 | 41.45,51.7 50.8,51.7 52.4,53.3 v52.4,73 | v52.4,80.9 52.4,128.94 CON3.4
  Bottom 0.61: v52.4,73 v52.4,80.9
DT3  (via drill 0.6)
  Top 0.61: IC3.5 41.16,24.3 R29.1 41.55,24 43.2,24 55.9,36.7 v55.9,45.9 | CON3.1 56.65,131.3 56.65,128.2 56.2,127.75 56.2,77.11 v56.1,77.2 | v55.9,71.2 55.9,49.6 v55.9,49.5
  Bottom 0.61: v56.1,77.2 56.1,71.4 v55.9,71.2 | v55.9,49.5 55.9,46 v55.9,45.9
DT4  (via drill 0.6)
  Top 0.406: 64.6,128.1 64.6,130.3 64.6,131.74 CON4.7
  Top 0.61: IC4.5 79.84,14.8 R30.1 79.55,15 70.2,15 69.1,16.1 v69.1,20.9 | 64.6,128.1 64.6,127.4 64.6,127.05 64.6,74.3 v67.2,71.8 | v68.85,70.15 69.1,69.9 69.1,50.1 v64.7,45.7 | v64.7,43.3 64.7,29 69.1,24.6 v69.1,23.6
  Bottom 0.61: v67.2,71.8 v68.85,70.15 | v64.7,45.7 v64.7,43.3 | v69.1,23.6 v69.1,20.9
DT5  (via drill 0.6)
  Top 0.61: IC5.5 79.55,42.2 R31.1 79.25,42.5 77,42.5 76.3,43.2 v76.2,43.2 | CON4.6 65.84,74.66 v68,72.6 | v69.75,70.85 70.2,70.4 70.2,51.8 v76.2,45.8
  Bottom 0.61: v68,72.6 v69.75,70.85 | v76.2,45.8 v76.2,43.2
DT6  (via drill 0.6)
  Top 0.406: 70.8,132.8 70.9,132.7 70.9,131.1 69.7,129.9 69.65,129.85 69.65,128.25 69.6,128.2
  Top 0.61: CON4.5 67.16,131.76 68.6,133.2 70.4,133.2 70.8,132.8 | 69.6,128.2 69.6,82.7 77.1,75.2 v77.1,73.2 | v77.1,70.75 77.15,70.7 77.75,70.1 79.45,70.1 R32.1 79.75,69.81 IC6.5
  Bottom 0.61: v77.1,73.2 v77.1,70.75
DT_1
  Top 0.61: 30,80.36 MOD_1.DT@12 30,80.36 | IC1.3 30,80.36
DT_2
  Top 0.61: 29.9,52.97 MOD_2.DT@12 29.9,52.97 | IC2.3 29.9,52.97
DT_3
  Top 0.61: 29.93,25.57 MOD_3.DT@12 29.93,25.57 | IC3.3 29.93,25.57
DT_4
  Top 0.61: 90.1,13.54 MOD_4.DT@12 90.1,13.54 | IC4.3 90.1,13.54
DT_5
  Top 0.61: IC5.3 90.07,40.94 MOD_5.DT@12
DT_6
  Top 0.61: 90.1,68.53 MOD_6.DT@12 90.1,68.53 | IC6.3 90.1,68.53
FRQSEL0  (via drill 0.6)
  Top 0.254: IC9.24 23.75,125.11 23.75,122.61 13.25,122.61 v13.25,124.61
  Top 0.61: R25.1 v13.25,128.86 R26.2
  Bottom 0.406: v13.25,124.61 v13.25,128.86
GND  (via drill 0.6)
  Top 0.25: 38.25,132.11 SH1.P$3 | 21.25,126.11 SH1.P$5 | 28.25,126.11 27.25,126.11 IC9.GND_VIA_5 | 28.25,126.11 29.25,126.11 IC9.GND_VIA_4 | 28.25,126.11 IC9.GND_VIA_3 28.25,125.11 29.25,125.11 IC9.GND_VIA_1
  Top 0.254: 27.55,121.01 C15.1 | IC9.2 32.25,124.11 32.25,123.31 C14.1 | IC9.20 24.3,127.11 24.3,127.2 v24.25,127.41 24.25,127.61 IC9.19 | IC9.11 29.75,129.11 29.1,129.11 C16.1 | IC9.15 27.75,130.96 v27.25,131.46 | 38.4_MHZ.PIN_2 v35.05,131.46
  Top 0.3: 29.4,127.11 IC9.GND_VIA_4
  Top 0.305: C13.1 35.45,121.11 | 27.75,121.31 C15.1 | IC9.30 27.25,121.41 C15.1 | IC9.8 31.7,127.11 31.7,128.1 | IC9.31 27.75,121.6 27.55,121.6 C15.1
  Top 0.406: C14.1 C20.1 | 27.55,121.01 27.55,120.31 | 21.65,127.41 SH1.P$5
  Top 0.61: IC4.8 81.8,10.99 | R13.1 R15.1 R26.1 v11.65,125.76 | SH1.P$9 23.25,117.48 | SH1.P$7 37.88,124.61 | IC10.4 IC10.3 33.75,139.97 33.75,144.45 C19.1 | 28.25,133.81 SH1.P$6 | v20.45,125.96 21.65,125.96 SH1.P$5 | LLK.A v20.25,140.61 | v21.55,135.06 21.6,135.16 21.6,133.1 21.57,132.46 SH1.P$2 | 21.6,133.81 23.75,133.81 SH1.P$10 | C16.1 v29.1,131.46 | R20.1 23.25,135.31 | 34.71,144.45 v33.75,144.41 | 37.55,133.75 37.6,133.7 37.88,133.43 SH1.P$3
  Top 0.813: 23.25,133.81 SH1.P$10
  Top 1.016: SH1.P$3 37.88,131.11 | SH1.P$1 21.57,119.11 v21.55,116.11 21.6,116.2 21.6,117.48 23.25,117.48 | SH1.P$5 21.65,126.61 | 30.75,117.48 SH1.P$8
  other vias: 58.75,39 58.75,34 82.05,9.1 81.6,63.75 71.2,75.45 38.8,85 66.1,62.4 53.6,54.4 53.6,59 40.4,28.1 38.5,30.5 58.75,29.05 64.55,23.95 66.2,56.2 66.3,51 62.2,56.3 62.25,51 62.25,62.5 35.55,123.96 27.15,119.71 39.95,124.01 28.95,138.71 28.05,135.01 23.3,135.56 39.95,119.26 35,116.01 30.02,116.01 98.85,146.61 85.05,145.01 84.75,123.11 84.85,124.81 83.35,126.26 86.25,121.61 85.35,129.36 84.85,127.76 83.75,127.96 101.8,125.66 104.45,126.56 108.05,126.66 37.05,135.01 22.95,132.06 84.15,11 86.95,15.8 59.25,62.6 59.3,56.4 59.25,51 57.2,48.4 57.3,45.7 53.6,64 53.6,69 16.15,102.21 17.75,103.71 19.35,102.11 92.55,103.91 90.85,102.21 94.35,102.21 62.15,39 62.05,34 38.6,58.1 80.4,39.65 80.4,38.45 82.4,36.05 80.35,12.2 80.35,11 86.25,124.61 103.3,127.16 100.2,127.06 5,149 10,149 15,149 20,149 25,149 30,149 35,149 40,149 45,149 50,149 55,149 60,149 65,149 70,149 75,149 80,149 85,149 90,149 95,149 100,149 105,149 110,149 115,149 110,144 110,139 105,139 105,144 115,139 115,134 115,129 115,124 115,119 115,114 115,109 110,109 110,114 110,104 105,104 105,109 95,104 95,109 95,114 100,114 100,119 105,119 90,119 90,114 90,109 90,104 85,104 85,109 85,114 85,119 80,119 80,114 80,109 80,104 75,104 75,109 75,114 75,119 75,124 80,124 80,134 80,139 75,134 70,139 65,139 65,134 60,134 50,134 45,134 50,139 55,139 55,134 40,139 40,144 25,144 25,139 15,144 15,139 15,134 5,139 5,134 5,129 5,124 5,119 5,114 15,119 20,119 15,114 20,114 25,114 30,114 35,114 40,114 45,114 45,119 45,124 45,109 40,109 35,109 30,109 35,104 40,104 45,104 45,99 40,99 45,94 45,89 35,94 35,89 40,89 20,104 20,109 15,109 15,104 10,104 10,109 5,109 45,84 45,74 40,74 50,74 50,69 45,69 40,69 40,64 45,64 50,64 50,59 45,59 40,59 35,44 40,44 50,44 50,39 45,39 40,39 35,39 35,34 40,34 45,34 50,34 45,29 55,29 55,24 55,19 60,19 60,24 65,19 50,19 45,19 40,19 35,19 35,14 40,14 45,14 50,14 55,14 60,14 65,14 70,9 65,9 60,9 55,9 50,9 45,9 40,9 35,9 35,4 30,4 25,4 20,4 15,4 10,4 40,4 45,4 50,4 55,4 60,4 65,4 70,4 75,4 80,4 85,4 90,4 95,4 100,4 105,4 110,4 75,9 80,9 60,124 60,119 60,114 60,109 60,104 60,99 60,94 60,89 60,84 60,79 60,74 75,99 80,99 85,99 85,94 80,94 75,94 75,89 80,89 80,84 75,84 75,79 80,79 75,69 75,64 75,59 75,54 80,54 80,49 80,59 80,64 70,49 75,38.7 75,34 70,34 80,34 85,34 85,29 80,29 75,29 70,29 75,24 80,24 85,24 85,19 80,19 75,19 70.15,19 84.15,14 38.5,29.2 40.4,26.8 38.6,56.6 40.5,55.5 40.5,54.2 45,54.3 50,54.4 70,38.7 35.2,51.7 40.4,50.7 45,50.7 50,50.7 53.5,50.7 19,125.96 25,116 38.45,135.01 28.95,140.01 33.45,139.41 99,138 100,134 90,134 90,129 105,134 85,139 80.05,145.01 75.05,145.01 70.05,145.01 65.05,145.01 60.05,145.01 55.05,145.01 50.05,145.01 93.65,146.71 90,139 100,129 96.9,138.6 95.7,138.6 96.3,137.7 22.95,127.06 31.3,129.11 31.85,130.56 33.95,131.46 28.45,119.86 29.65,119.91 31.65,119.91 32.95,119.91 35.4,119.86 34.25,119.86 35.5,122.81 34.4,122.26 33.05,122.21 23.15,121.46 23.1,120.16 23.05,118.86 20.35,124.61 20.4,127.36 19,127.41 18.95,124.61 24.5,132.01 25.25,135.06 25,136.96 28.05,136.61 28.05,138.16 29.8,137.26 31.3,137.26 33.2,137.21 34.7,137.66 38.4,139.81 38.4,138.06 40.9,132.11 40.95,130.11 42.1,131.01 21.75,138.71 18.8,138.66 20.2,133.31 18.85,140.56 21.7,140.56 21.8,136.86 20,120.25 20,121.5 20,117.65 20,116.3 39.95,127.06 39.95,125.56 40.05,122.31 40,120.81 40,117.66 40,116.01 38.3,115.96 36.8,115.96 33.4,116.01 31.8,116.01 28.5,116.06 23.4,116.11 24.8,141.4 26.2,141.4 27.3,142.4 29,142.4 35.2,143.6 37.1,143.6 38.5,144.2 41.6,143 43,141.6 44.4,141.6 20.2,134.71
  pour Bottom (isolate 0.254, rank 6): 0.5,150 119.5,150 119.5,-2 0.5,-2
  pour Top (isolate 0.254, rank 6): 0.5,-2 119.5,-2 119.5,150 0.5,150
GND_CABLE
  Top 0.406: 80.75,129.22 L3.2
  Top 1.016: 80.75,129.22 76.75,129.22 CON4.2
GNDA  (via drill 0.6)
  Top 0.406: v98,92 IC8.2
  other vias: 101.5,93.9 94.05,91.7 95.85,95.9 94.45,99 94.45,100.3 94.45,97.7 90.85,100.3 92.65,98.7 90,99 90,94 100,94 105,94 110,94 115,94 115,99 110,99 105,99 100,89 105,89 110,89 115,89
  pour Top (isolate 0.254): 89.5,7 119.5,7 119.5,64 113.5,64 113.5,76 119.5,76 119.5,101 89.5,101
  pour Bottom (isolate 0.254): 89.5,7 119.5,7 119.5,9 113.5,9 113.5,21 119.5,21 119.5,37 113.5,37 113.5,49 119.5,49 119.5,64 113.5,64 113.5,76 119.5,76 119.5,101 89.5,101
LOL
  Top 0.254: IC9.18 22.75,128.32
  Top 0.305: 22.75,128.32 22.25,128.86 22.15,128.86
  Top 0.61: R18.2 19.55,128.86 22.15,128.86
N$1
  Top 0.813: PWR.A 82.8,136.71 R17.2
N$2
  Top 0.5: 101.1,137.8 101.1,136.6
N$11
  Top 0.61: R18.1 19.55,132.25 18.6,133.2 18.6,136.2 18.9,136.5 20.19,136.5 LLK.C
RO_CLK
  Top 0.406: C17.2 | 26.75,140.25 26.74,140.25 | 23.25,140.25 23.25,139.61
  Top 0.61: C17.2 25.75,132.11 26.75,133.11 26.74,133.12 26.74,135.47 26.74,140.25 23.25,140.25 | 26.75,140.25 27.75,141.25 IC10.2
  Top 0.813: R19.1 23.25,139.61 R20.2
VDD  (via drill 0.6)
  Top 0.254: IC9.25 24.75,124.61 24.45,124.61 | 28.75,122.11 28.25,122.11 IC9.32 | 28.75,122.11 28.75,121.11 C15.2 | C16.2 30.4,129.11 30.25,129.11 IC9.10 | IC9.26 24.45,124.11 | IC9.27 24.55,123.61 24.45,123.51 | IC9.33 28.75,122.11 | IC9.5 31.75,125.61
  Top 0.305: 31.75,125.61 33.05,125.61 | 33.05,125.61 C14.2 | 33.05,125.61 36.5,125.61 | 28.95,121.11 C15.2 | 24.45,124.11 24.45,124.61
  Top 0.406: C14.2 C20.2 | 24.45,124.11 24.45,123.61 24.45,123.51 | 28.95,121.11 R16.2 30.6,118.81 28.95,118.81 | R21.2 35.6,135.65
  Top 0.61: C16.2 30.4,131.11 31,131.71 32.55,131.71 33.45,132.61 36.5,132.61 36.5,128.61 | 36.5,128.61 36.5,125.61 36.5,118.81 30.6,118.81 28.95,118.81 v27.85,118.81 | 24.45,123.51 24.45,119.61 v25.25,118.81 | 36.5,128.61 L2.2 39.65,136.81 35.6,136.81 35.6,135.65 R21.2
  Bottom 0.61: v25.25,118.81 v27.85,118.81
VDD_2
  Top 0.61: 23.25,146.21 R19.2
  Top 0.813: L1.2 23.25,146.21 22.45,146.21 17.45,141.21 R12.2 R14.2 R25.2
XA
  Top 0.254: IC9.6 34.8,126.11 arc90 35.05,126.36 38.4_MHZ.PIN_1
XB
  Top 0.254: IC9.7 32.25,126.61 32.25,129.21 arc-90 32.75,129.71 38.4_MHZ.PIN_3

### Text on the board
Top: T
Bottom: B
tNames: (6) | (1) | (5) | (2) | (4) | (3) | TART Tile / RF Board / (c)2015
_tsilk: L1 | 1 | 2 | C1 | IC1 | R13 | R9 | R14 | 3 | 4 | C9 | IC3 | R8 | C10 | LLK | R11 | R12 | R15 | PWR | R2 | R4 | R6 | C3 | C4 | L3 | R7 | L2 | C2 | CON3 | CON4 | D1 | C11 | C6 | C12 | IC2 | C7 | R1 | R3 | R5 | C5 | R10 | C8 | IC4 | CON1 | 8 | CON2 | 8 | C13 | SH1 | 1 | 1 | TART clock module (c)2014 | 8 | 8 | 1 | 1 | CON1 | CON2 | TART radio module (c)2014 | MOD_1 | MOD_4 | MOD_2 | MOD_3 | MOD_5 | MOD_6 | C3 | R9 | R10 | R7 | R8 | D1 | C8 | C7 | R11 | C9 | C12 | IC7 | C10 | C11 | IC8
_bsilk: R1 | IC1 | C6 | C1 | R2 | IC6 | C2 | R6 | IC2 | R5 | C5 | IC5 | R4 | R3 | C4 | IC3 | IC4